# EAGLE board hodiny2_4beta (EAGLE 5.11), part 1 of 2
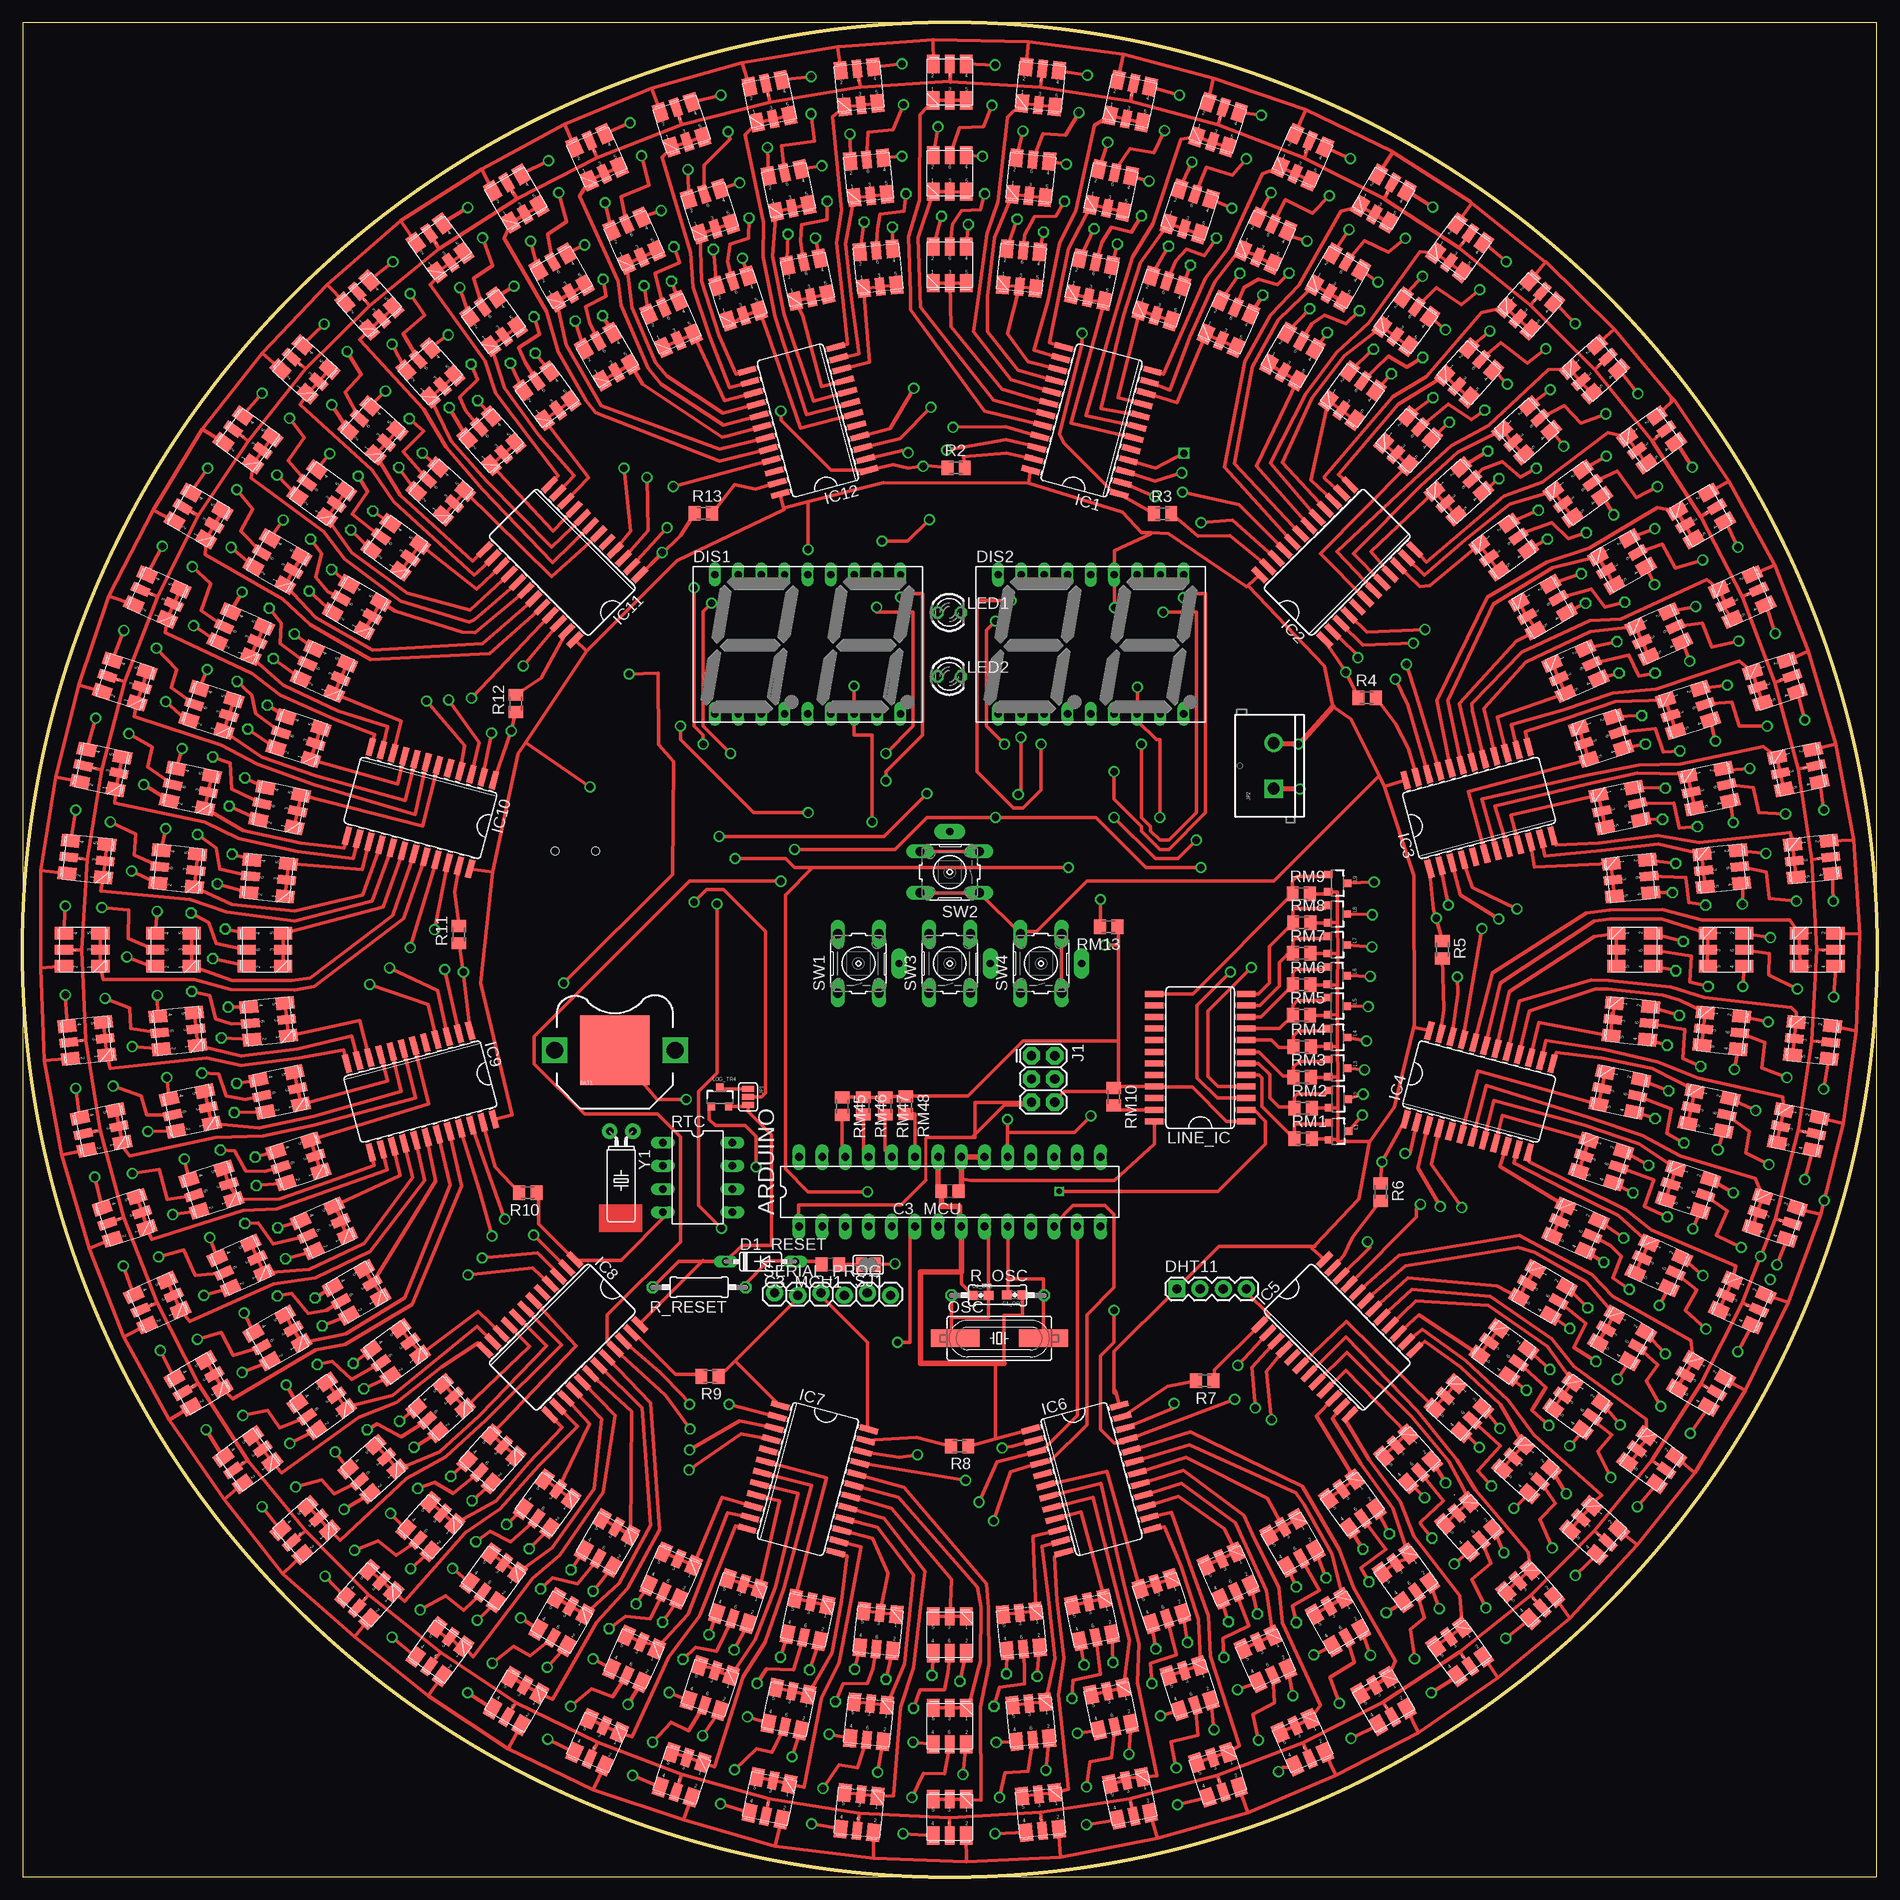
[diagram p6: board, top side]
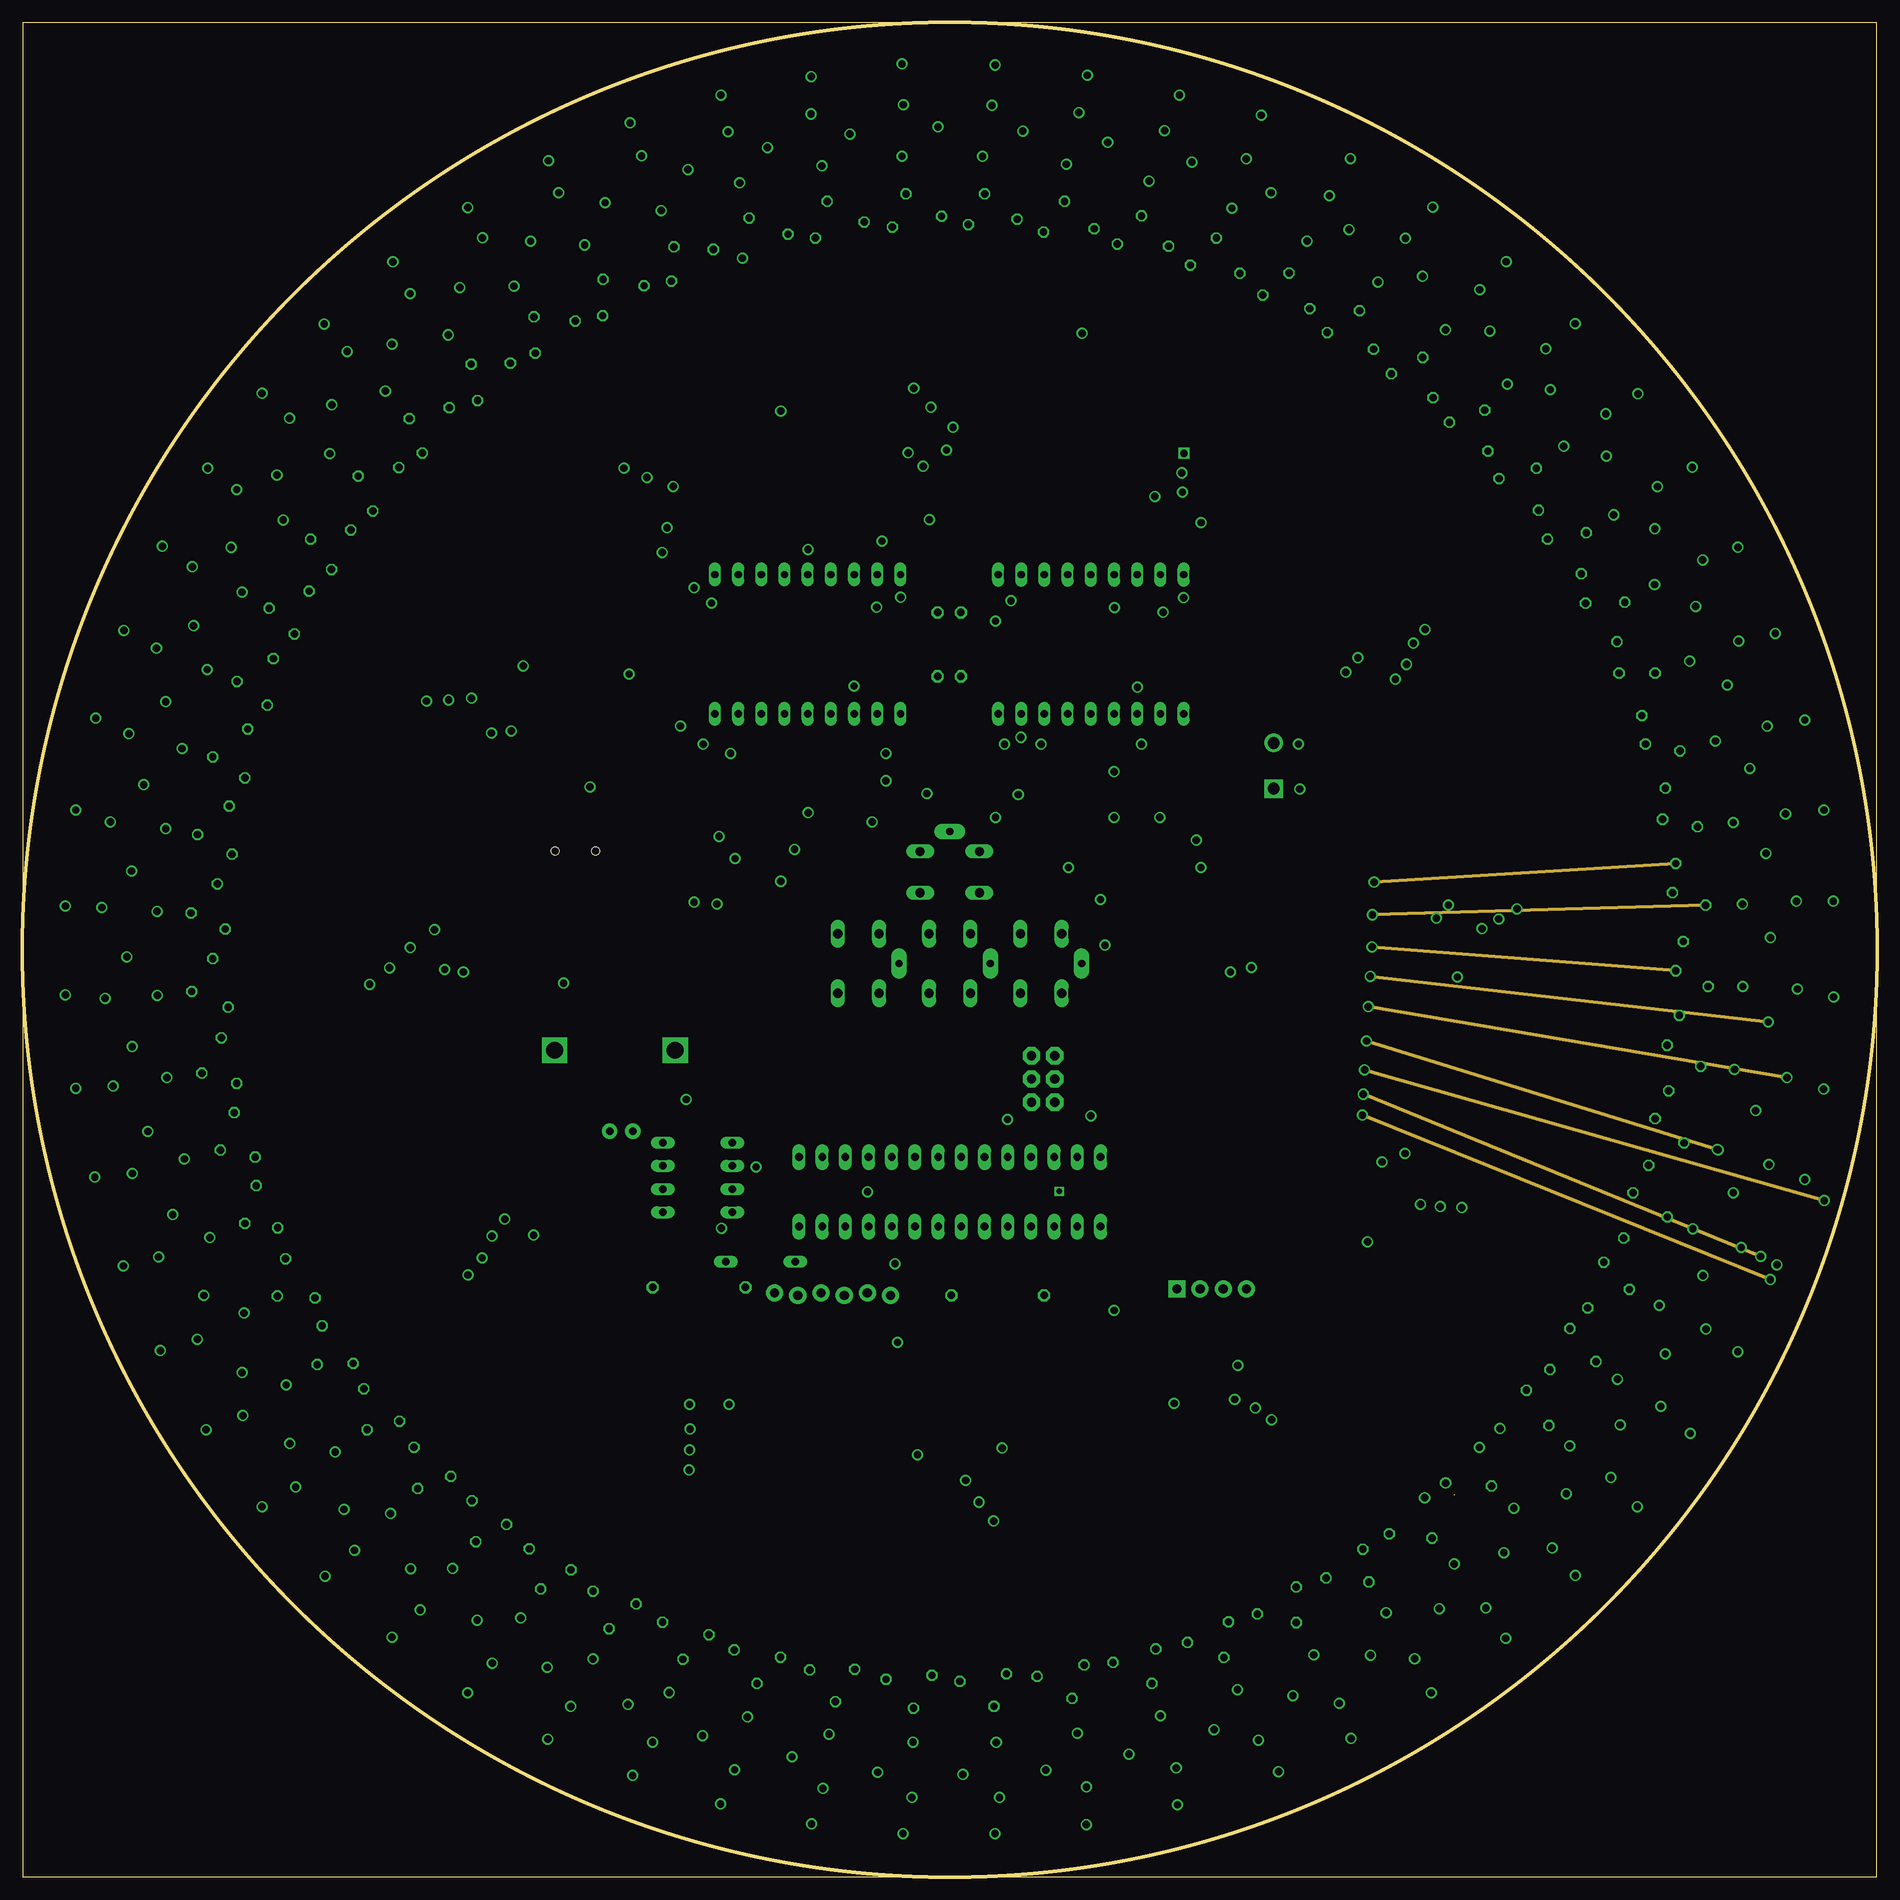
[diagram p7: board, inner layer Route14]
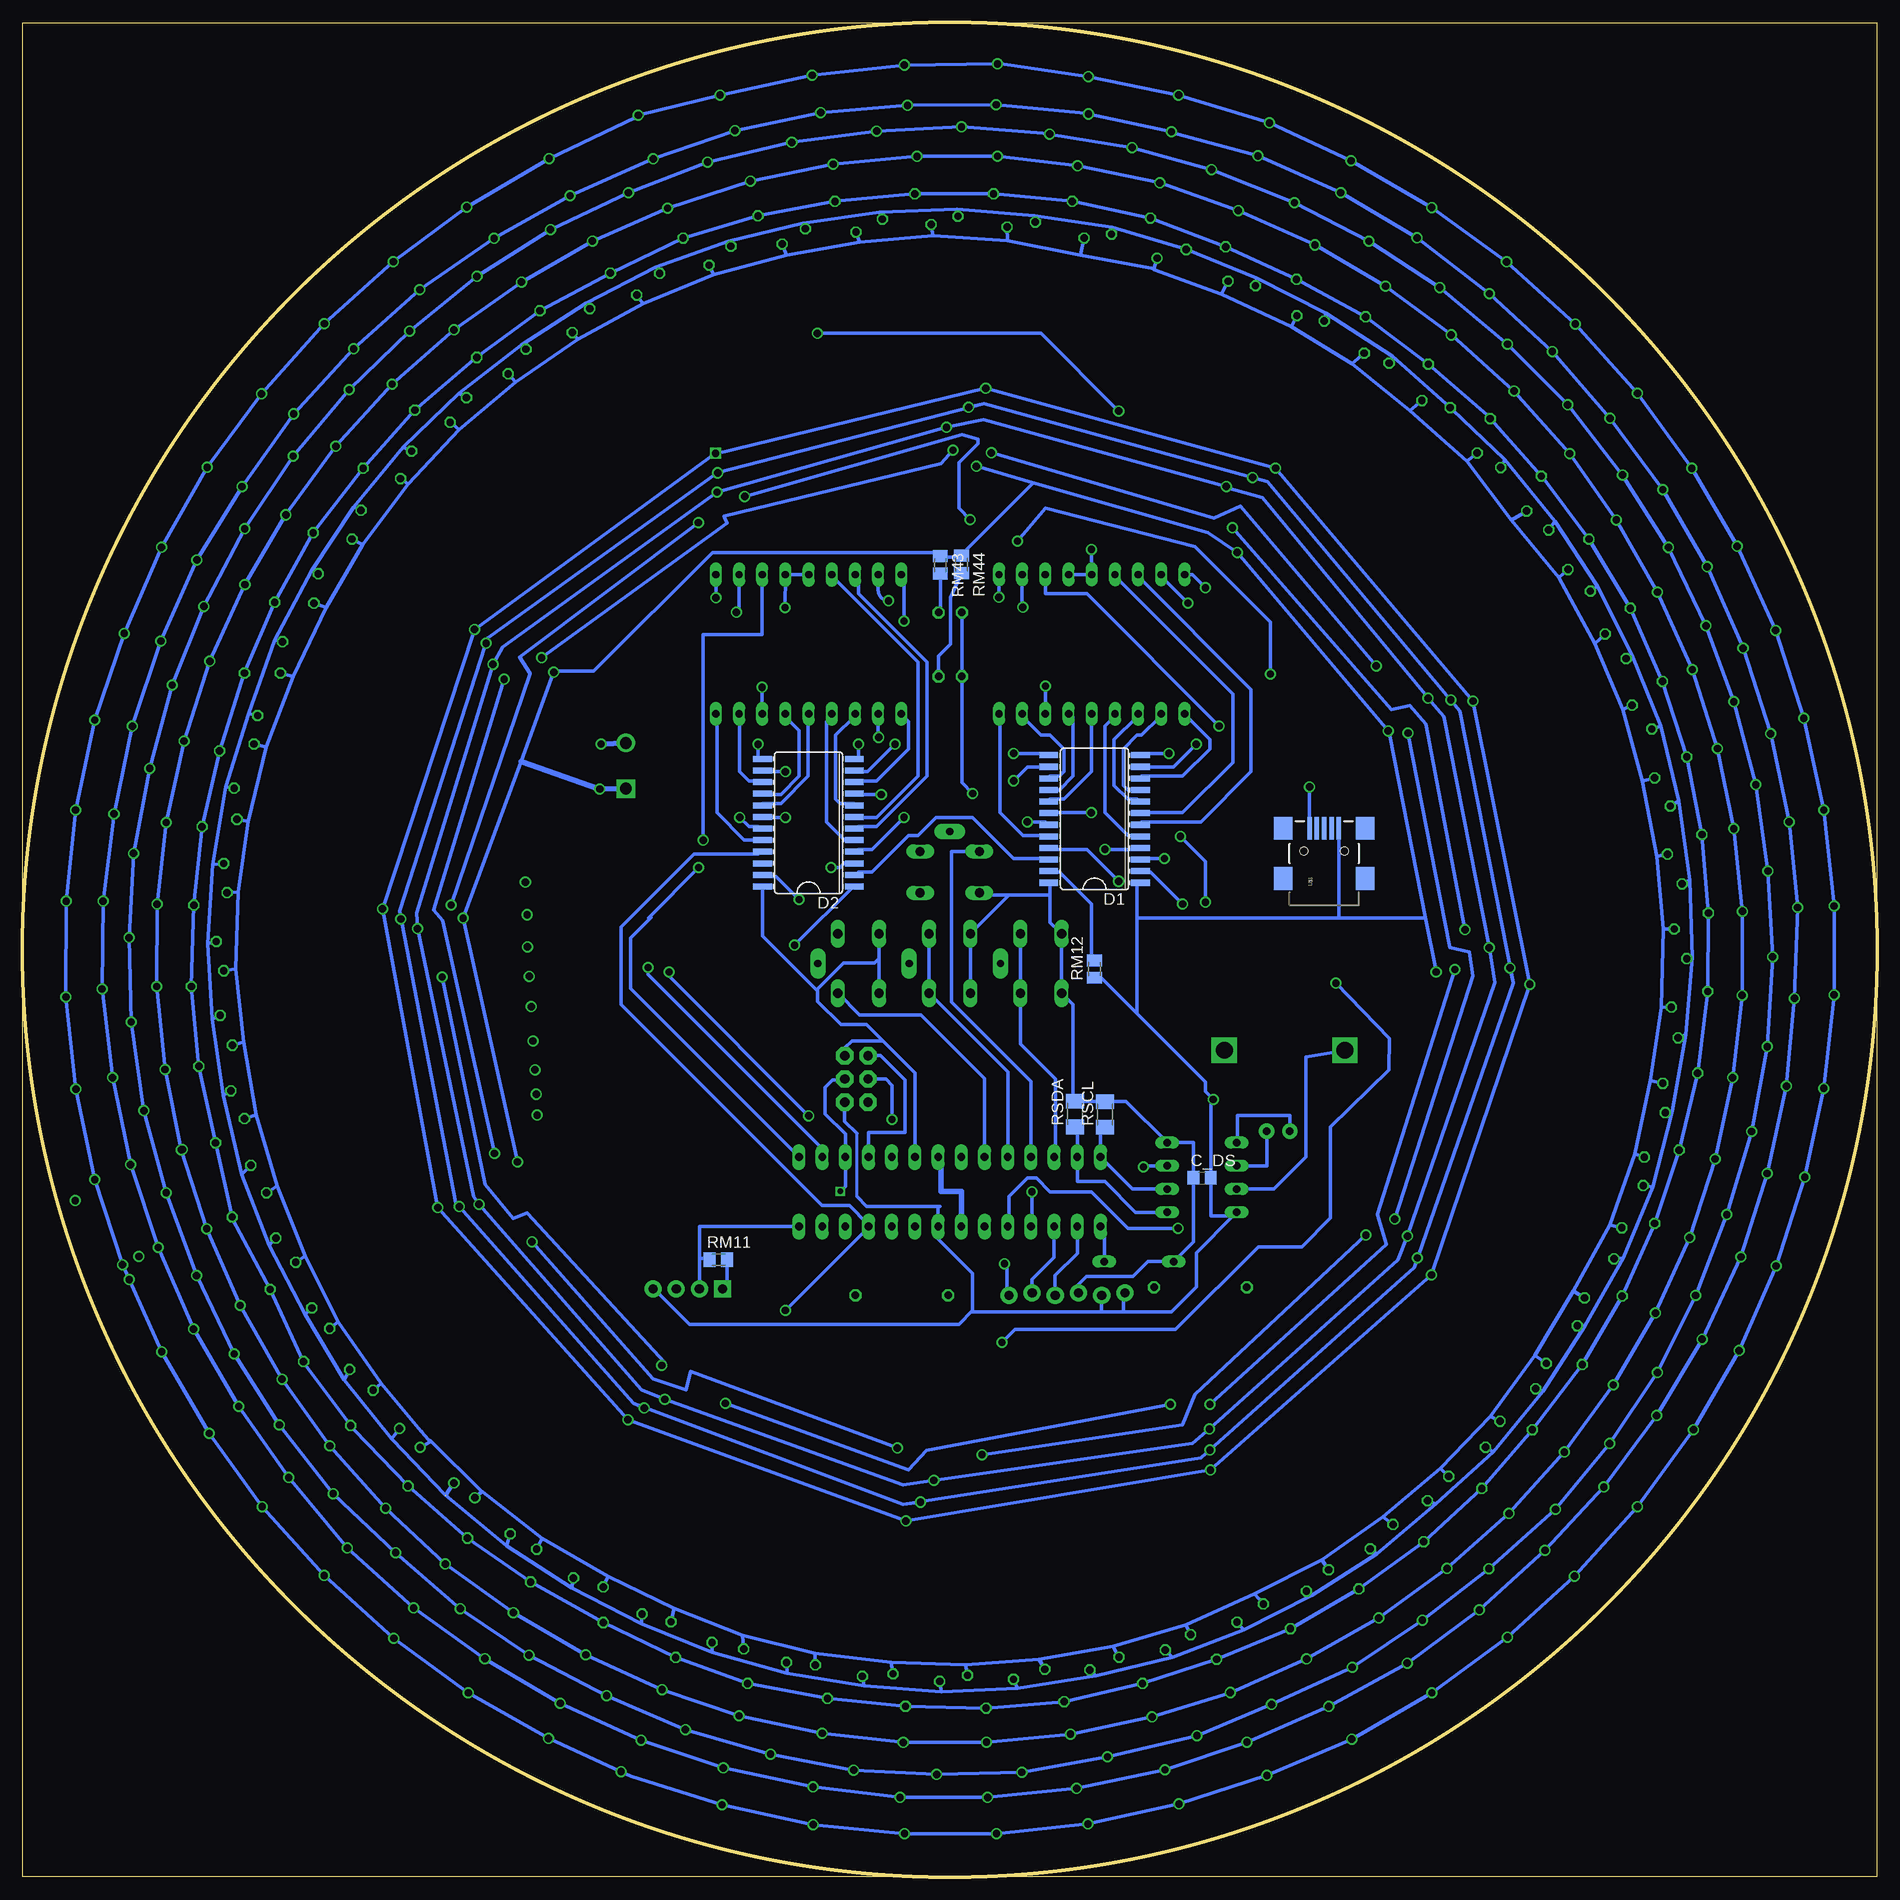
[diagram p8: board, bottom side, seen from below]

Size 203 x 203 mm. Coordinates in mm from the lower left corner, seen from the top.
Outline: 0,0 203,0 203,203 0,203 0,0
Outline: circle at 101.5,101.5 radius 101.5
Copper layers (1*14*15*16): Top 0.035mm / dielectric 1.5mm / Route14 0.035mm / dielectric 0.15mm / Route15 0.035mm / dielectric 0.2mm / Bottom-w 0.035mm
Design rules "default *": minimum track width 0.4mm, minimum drill 0.8mm, track to track 0.3mm, track to pad 0.3mm, pad to pad 0.3mm, via to via 0.3mm, smd to smd 0.2mm, copper to edge 40mil, drill to drill 1mm, minimum pad ring 10mil, minimum via ring 8mil, stop-mask expansion 0mil, vias tented up to drill 0mil, thermal gap 10mil

## Footprints (pad centres in the part's own frame; a part is rotated, then mirrored left to right if it is on the bottom)
SMARTPRJ_DIL28-3 = drill 0.85 pad 1.422 long: 1 -16.51,-3.81; 2 -13.97,-3.81; 3 -11.43,-3.81; 4 -8.89,-3.81; 5 -6.35,-3.81; 6 -3.81,-3.81; 7 -1.27,-3.81; 8 1.27,-3.81; 9 3.81,-3.81; 10 6.35,-3.81; 11 8.89,-3.81; 12 11.43,-3.81; 13 13.97,-3.81; 14 16.51,-3.81; 15 16.51,3.81; 16 13.97,3.81; 17 11.43,3.81; 18 8.89,3.81; 19 6.35,3.81; 20 3.81,3.81; 21 1.27,3.81; 22 -1.27,3.81; 23 -3.81,3.81; 24 -6.35,3.81; 25 -8.89,3.81; 26 -11.43,3.81; 27 -13.97,3.81; 28 -16.51,3.81
BATTCON_12MM_PTH = smd 7.62 x 7.62: GND 0,0 | drill 1.854 square: VCC@1 -6.604,0; VCC@2 6.604,0
0603-CAP = smd 1.1 x 1: 1 -0.85,0; 2 0.85,0
C0805 = smd 1.3 x 1.5: 1 -0.95,0; 2 0.95,0
SO24W = smd 0.66 x 2.032: 1 -6.985,-5.029; 2 -5.715,-5.029; 3 -4.445,-5.029; 4 -3.175,-5.029; 5 -1.905,-5.029; 6 -0.635,-5.029; 7 0.635,-5.029; 8 1.905,-5.029; 9 3.175,-5.029; 10 4.445,-5.029; 11 5.715,-5.029; 12 6.985,-5.029; 13 6.985,5.029; 14 5.715,5.029; 15 4.445,5.029; 16 3.175,5.029; 17 1.905,5.029; 18 0.635,5.029; 19 -0.635,5.029; 20 -1.905,5.029; 21 -3.175,5.029; 22 -4.445,5.029; 23 -5.715,5.029; 24 -6.985,5.029
DO35-7 = drill 0.813 long: A 3.81,0; C -3.81,0
1X04 = drill 1.016 pad 1.88 square: 1 0,0 | drill 1.016 pad 1.88 round: 2 2.54,0; 3 5.08,0; 4 7.62,0
HDSP-R = drill 0.813 long: 1 -10.16,-7.62; 2 -7.62,-7.62; 3 -5.08,-7.62; 4 -2.54,-7.62; 5 0,-7.62; 6 2.54,-7.62; 7 5.08,-7.62; 8 7.62,-7.62; 9 10.16,-7.62; 10 10.16,7.62; 11 7.62,7.62; 12 5.08,7.62; 13 2.54,7.62; 14 0,7.62; 15 -2.54,7.62; 16 -5.08,7.62; 17 -7.62,7.62; 18 -10.16,7.62
PLCC6 = smd 1.4 x 2: 1 1.8,2; 2 1.8,-2; 5 -1.8,2; 6 -1.8,-2 | smd 1 x 2: 3 0,2; 4 0,-2
2X3 = drill 1.016 pad 1.88 octagon: 1 0,0; 2 0,2.54; 3 2.54,0; 4 2.54,2.54; 5 5.08,0; 6 5.08,2.54
SJ_3 = smd 0.635 x 1.27: 1 -0.889,0; 2 0,0; 3 0.889,0
SCREWTERMINAL-5MM-2 = drill 1.3 pad 2.032 square: 1 0,0 | drill 1.3 pad 2.032 round: 2 5,0
SOT23-3 = smd 0.8 x 0.9: 1 -0.95,-1; 2 0.95,-1; 3 0,1.1
LED_LED3MM = drill 0.813 octagon: A -1.27,0; K 1.27,0
HC49UP = smd 5.334 x 1.93: 1 -4.826,0; 2 4.826,0
M0805 = smd 1.3 x 1.6: 1 -0.95,0; 2 0.95,0
0207/10 = drill 0.813 octagon: 1 -5.08,0; 2 5.08,0
SMARTPRJ_M1206 = smd 1.6 x 2: 1 -1.4,0; 2 1.4,0
DIL08 = drill 0.813 long: 1 -3.81,-3.81; 2 -1.27,-3.81; 3 1.27,-3.81; 4 3.81,-3.81; 5 3.81,3.81; 6 1.27,3.81; 7 -1.27,3.81; 8 -3.81,3.81
1X06_LOCK = drill 1.016 pad 1.88 round: 1 0,0; 2 2.54,-0.254; 3 5.08,0; 4 7.62,-0.254; 5 10.16,0; 6 12.7,-0.254
SJ = smd 1.168 x 1.6: 1 -0.762,0; 2 0.762,0
B3F-11XX = drill 1.016 long: 1 -3.251,2.261; 2 3.251,2.261; 3 -3.251,-2.261; 4 3.251,-2.261 | drill 0.8 pad 1.676 long: P$1 0,-4.445
USB-MINIB = smd 2.5 x 0.5: D+ 2.5,0; D- 2.5,0.8; GND 2.5,-1.6; ID 2.5,-0.8; VBUS 2.5,1.6 | smd 2.5 x 2: MTN1 -3,4.5; MTN2 2.5,4.5; MTN3 -3,-4.5; MTN4 2.5,-4.5 | hole 0.9: 0,2.2; 0,-2.2
TC38H = drill 0.813 pad 1.676 round: 1 -1.27,0; 2 1.27,0

## Placement (x,y rotation side)
ARDUINO  ATMEGA328P-PU  [SMARTPRJ_DIL28-3]  101.5,75 0 top
BAT1  [BATTCON_12MM_PTH]  64.84,90.5 0 top
C1_OSC  22pF  [0603-CAP]  108.6,63.69 180 top
C2_OSC  22pF  [0603-CAP]  104.89,63.66 0 top
C3_MCU  100nF  [C0805]  101.52,75.06 180 top
C3_MCU1  100nF  [C0805]  88.42,67.04 180 top
C_DS  100nF  [C0805]  73.87,76.53 0 bottom
D1  TLC5925SOIC24  [SO24W]  85.64,115.82 90 bottom
D1_RESET  1N4148  [DO35-7]  80.77,67.36 0 top
D2  TLC5925SOIC24  [SO24W]  116.97,115.41 90 bottom
DHT11  [1X04]  126.37,64.37 0 top
DIS1  HD-K121  [HDSP-R]  85.95,134.96 0 top
DIS2  HD-K121  [HDSP-R]  116.95,134.96 0 top
H0  PLCC6RGB  [PLCC6]  101.5,176.5 180 top
H1  PLCC6RGB  [PLCC6]  109.34,176.09 174 top
H2  PLCC6RGB  [PLCC6]  117.09,174.86 168 top
H3  PLCC6RGB  [PLCC6]  124.68,172.83 162 top
H4  PLCC6RGB  [PLCC6]  132.01,170.02 156 top
H5  PLCC6RGB  [PLCC6]  139,166.45 150 top
H6  PLCC6RGB  [PLCC6]  145.58,162.18 144 top
H7  PLCC6RGB  [PLCC6]  151.68,157.24 138 top
H8  PLCC6RGB  [PLCC6]  157.24,151.68 132 top
H9  PLCC6RGB  [PLCC6]  162.18,145.58 126 top
H10  PLCC6RGB  [PLCC6]  166.45,139 120 top
H11  PLCC6RGB  [PLCC6]  170.02,132.01 114 top
H12  PLCC6RGB  [PLCC6]  172.83,124.68 108 top
H13  PLCC6RGB  [PLCC6]  174.86,117.09 102 top
H14  PLCC6RGB  [PLCC6]  176.09,109.34 96 top
H15  PLCC6RGB  [PLCC6]  176.5,101.5 90 top
H16  PLCC6RGB  [PLCC6]  176.09,93.66 84 top
H17  PLCC6RGB  [PLCC6]  174.86,85.91 78 top
H18  PLCC6RGB  [PLCC6]  172.83,78.32 72 top
H19  PLCC6RGB  [PLCC6]  170.02,70.99 66 top
H20  PLCC6RGB  [PLCC6]  166.45,64 60 top
H21  PLCC6RGB  [PLCC6]  162.18,57.42 54 top
H22  PLCC6RGB  [PLCC6]  157.24,51.32 48 top
H23  PLCC6RGB  [PLCC6]  151.68,45.76 42 top
H24  PLCC6RGB  [PLCC6]  145.58,40.82 36 top
H25  PLCC6RGB  [PLCC6]  139,36.55 30 top
H26  PLCC6RGB  [PLCC6]  132.01,32.98 24 top
H27  PLCC6RGB  [PLCC6]  124.68,30.17 18 top
H28  PLCC6RGB  [PLCC6]  117.09,28.14 12 top
H29  PLCC6RGB  [PLCC6]  109.34,26.91 6 top
H30  PLCC6RGB  [PLCC6]  101.5,26.5 0 top
H31  PLCC6RGB  [PLCC6]  93.66,26.91 354 top
H32  PLCC6RGB  [PLCC6]  85.91,28.14 348 top
H33  PLCC6RGB  [PLCC6]  78.32,30.17 342 top
H34  PLCC6RGB  [PLCC6]  70.99,32.98 336 top
H35  PLCC6RGB  [PLCC6]  64,36.55 330 top
H36  PLCC6RGB  [PLCC6]  57.42,40.82 324 top
H37  PLCC6RGB  [PLCC6]  51.32,45.76 318 top
H38  PLCC6RGB  [PLCC6]  45.76,51.32 312 top
H39  PLCC6RGB  [PLCC6]  40.82,57.42 306 top
H40  PLCC6RGB  [PLCC6]  36.55,64 300 top
H41  PLCC6RGB  [PLCC6]  32.98,70.99 294 top
H42  PLCC6RGB  [PLCC6]  30.17,78.32 288 top
H43  PLCC6RGB  [PLCC6]  28.14,85.91 282 top
H44  PLCC6RGB  [PLCC6]  26.91,93.66 276 top
H45  PLCC6RGB  [PLCC6]  26.5,101.5 270 top
H46  PLCC6RGB  [PLCC6]  26.91,109.34 264 top
H47  PLCC6RGB  [PLCC6]  28.14,117.09 258 top
H48  PLCC6RGB  [PLCC6]  30.17,124.68 252 top
H49  PLCC6RGB  [PLCC6]  32.98,132.01 246 top
H50  PLCC6RGB  [PLCC6]  36.55,139 240 top
H51  PLCC6RGB  [PLCC6]  40.82,145.58 234 top
H52  PLCC6RGB  [PLCC6]  45.76,151.68 228 top
H53  PLCC6RGB  [PLCC6]  51.32,157.24 222 top
H54  PLCC6RGB  [PLCC6]  57.42,162.18 216 top
H55  PLCC6RGB  [PLCC6]  64,166.45 210 top
H56  PLCC6RGB  [PLCC6]  70.99,170.02 204 top
H57  PLCC6RGB  [PLCC6]  78.32,172.83 198 top
H58  PLCC6RGB  [PLCC6]  85.91,174.86 192 top
H59  PLCC6RGB  [PLCC6]  93.66,176.09 186 top
IC1  TLC5925SOIC24  [SO24W]  117.03,159.46 75 top
IC2  TLC5925SOIC24  [SO24W]  143.93,143.93 45 top
IC3  TLC5925SOIC24  [SO24W]  159.46,117.03 15 top
IC4  TLC5925SOIC24  [SO24W]  159.46,85.97 345 top
IC5  TLC5925SOIC24  [SO24W]  143.93,59.07 315 top
IC6  TLC5925SOIC24  [SO24W]  117.03,43.54 285 top
IC7  TLC5925SOIC24  [SO24W]  85.97,43.54 255 top
IC8  TLC5925SOIC24  [SO24W]  59.07,59.07 225 top
IC9  TLC5925SOIC24  [SO24W]  43.54,85.97 195 top
IC10  TLC5925SOIC24  [SO24W]  43.54,117.03 165 top
IC11  TLC5925SOIC24  [SO24W]  59.07,143.93 135 top
IC12  TLC5925SOIC24  [SO24W]  85.97,159.46 105 top
J1  AVR_SPI_PRG_6PTH  [2X3]  110.46,89.89 270 top
JP1  JUMPER-3SMD  [SJ_3]  79.41,85.38 270 top
JP2  [SCREWTERMINAL-5MM-2]  136.97,119.15 90 top
L1  P-FET  [SOT23-3]  144.03,81.63 270 top
L2  P-FET  [SOT23-3]  144.01,85.15 270 top
L3  P-FET  [SOT23-3]  143.95,88.53 270 top
L4  P-FET  [SOT23-3]  143.92,91.89 270 top
L5  P-FET  [SOT23-3]  143.9,95.32 270 top
L6  P-FET  [SOT23-3]  143.88,98.66 270 top
L7  P-FET  [SOT23-3]  143.88,102.03 270 top
L8  P-FET  [SOT23-3]  143.9,105.41 270 top
L9  P-FET  [SOT23-3]  143.93,108.78 270 top
LED1  [LED_LED3MM]  101.45,138.44 0 top
LED2  [LED_LED3MM]  101.45,131.44 0 top
LINE_IC  TLC5925SOIC24  [SO24W]  128.93,89.69 90 top
LOG_TR4  BCR198  [SOT23-3]  76.34,85.33 0 top
M0  PLCC6RGB  [PLCC6]  101.5,186.5 180 top
M1  PLCC6RGB  [PLCC6]  110.38,186.03 174 top
M2  PLCC6RGB  [PLCC6]  119.17,184.64 168 top
M3  PLCC6RGB  [PLCC6]  127.77,182.34 162 top
M4  PLCC6RGB  [PLCC6]  136.07,179.15 156 top
M5  PLCC6RGB  [PLCC6]  144,175.11 150 top
M6  PLCC6RGB  [PLCC6]  151.46,170.27 144 top
M7  PLCC6RGB  [PLCC6]  158.38,164.67 138 top
M8  PLCC6RGB  [PLCC6]  164.67,158.38 132 top
M9  PLCC6RGB  [PLCC6]  170.27,151.46 126 top
M10  PLCC6RGB  [PLCC6]  175.11,144 120 top
M11  PLCC6RGB  [PLCC6]  179.15,136.07 114 top
M12  PLCC6RGB  [PLCC6]  182.34,127.77 108 top
M13  PLCC6RGB  [PLCC6]  184.64,119.17 102 top
M14  PLCC6RGB  [PLCC6]  186.03,110.38 96 top
M15  PLCC6RGB  [PLCC6]  186.5,101.5 90 top
M16  PLCC6RGB  [PLCC6]  186.03,92.62 84 top
M17  PLCC6RGB  [PLCC6]  184.64,83.83 78 top
M18  PLCC6RGB  [PLCC6]  182.34,75.23 72 top
M19  PLCC6RGB  [PLCC6]  179.15,66.93 66 top
M20  PLCC6RGB  [PLCC6]  175.11,59 60 top
M21  PLCC6RGB  [PLCC6]  170.27,51.54 54 top
M22  PLCC6RGB  [PLCC6]  164.67,44.62 48 top
M23  PLCC6RGB  [PLCC6]  158.38,38.33 42 top
M24  PLCC6RGB  [PLCC6]  151.46,32.73 36 top
M25  PLCC6RGB  [PLCC6]  144,27.89 30 top
M26  PLCC6RGB  [PLCC6]  136.07,23.85 24 top
M27  PLCC6RGB  [PLCC6]  127.77,20.66 18 top
M28  PLCC6RGB  [PLCC6]  119.17,18.36 12 top
M29  PLCC6RGB  [PLCC6]  110.38,16.97 6 top
M30  PLCC6RGB  [PLCC6]  101.5,16.5 0 top
M31  PLCC6RGB  [PLCC6]  92.62,16.97 354 top
M32  PLCC6RGB  [PLCC6]  83.83,18.36 348 top
M33  PLCC6RGB  [PLCC6]  75.23,20.66 342 top
M34  PLCC6RGB  [PLCC6]  66.93,23.85 336 top
M35  PLCC6RGB  [PLCC6]  59,27.89 330 top
M36  PLCC6RGB  [PLCC6]  51.54,32.73 324 top
M37  PLCC6RGB  [PLCC6]  44.62,38.33 318 top
M38  PLCC6RGB  [PLCC6]  38.33,44.62 312 top
M39  PLCC6RGB  [PLCC6]  32.73,51.54 306 top
M40  PLCC6RGB  [PLCC6]  27.89,59 300 top
M41  PLCC6RGB  [PLCC6]  23.85,66.93 294 top
M42  PLCC6RGB  [PLCC6]  20.66,75.23 288 top
M43  PLCC6RGB  [PLCC6]  18.36,83.83 282 top
M44  PLCC6RGB  [PLCC6]  16.97,92.62 276 top
M45  PLCC6RGB  [PLCC6]  16.5,101.5 270 top
M46  PLCC6RGB  [PLCC6]  16.97,110.38 264 top
M47  PLCC6RGB  [PLCC6]  18.36,119.17 258 top
M48  PLCC6RGB  [PLCC6]  20.66,127.77 252 top
M49  PLCC6RGB  [PLCC6]  23.85,136.07 246 top
M50  PLCC6RGB  [PLCC6]  27.89,144 240 top
M51  PLCC6RGB  [PLCC6]  32.73,151.46 234 top
M52  PLCC6RGB  [PLCC6]  38.33,158.38 228 top
M53  PLCC6RGB  [PLCC6]  44.62,164.67 222 top
M54  PLCC6RGB  [PLCC6]  51.54,170.27 216 top
M55  PLCC6RGB  [PLCC6]  59,175.11 210 top
M56  PLCC6RGB  [PLCC6]  66.93,179.15 204 top
M57  PLCC6RGB  [PLCC6]  75.23,182.34 198 top
M58  PLCC6RGB  [PLCC6]  83.83,184.64 192 top
M59  PLCC6RGB  [PLCC6]  92.62,186.03 186 top
OSC  16MHz  [HC49UP]  106.93,58.95 0 top
R2  [M0805]  102.2,154.28 0 top
R3  [M0805]  124.8,149.25 0 top
R4  [M0805]  147.19,129.09 0 top
R5  [M0805]  155.45,101.51 270 top
R6  [M0805]  148.67,74.96 270 top
R7  [M0805]  129.42,54.31 180 top
R8  [M0805]  102.58,47.14 180 top
R9  [M0805]  75.24,54.79 180 top
R10  [M0805]  55.29,74.91 180 top
R11  [M0805]  47.76,103.17 90 top
R12  [M0805]  53.98,128.46 90 top
R13  [M0805]  74.53,149.28 0 top
R_OSC  1M  [0207/10]  106.75,63.66 0 top
R_RESET  10k  [0207/10]  74.05,64.55 180 top
RM1  [M0805]  140.2,80.81 0 top
RM2  [M0805]  140.2,84.15 0 top
RM3  [M0805]  140.1,87.54 0 top
RM4  [M0805]  140.08,90.89 0 top
RM5  [M0805]  140.01,94.32 0 top
RM6  [M0805]  140.03,97.66 0 top
RM7  [M0805]  140.03,101.1 0 top
RM8  [M0805]  140.05,104.45 0 top
RM9  [M0805]  140,107.62 0 top
RM10  [M0805]  119.43,85.4 270 top
RM11  [M0805]  126.84,67.58 0 bottom
RM12  [M0805]  85.66,99.38 90 bottom
RM13  [M0805]  118.9,104.01 180 top
RM43  [M0805]  102.53,143.64 270 bottom
RM44  [M0805]  100.22,143.69 270 bottom
RM45  [M0805]  89.72,84.36 270 top
RM46  [M0805]  92.04,84.41 270 top
RM47  [M0805]  94.43,84.38 270 top
RM48  [M0805]  96.7,84.47 270 top
RSCL  2k2  [SMARTPRJ_M1206]  84.5,83.47 90 bottom
RSDA  2k2  [SMARTPRJ_M1206]  87.79,83.5 90 bottom
RTC  DS1307  [DIL08]  73.87,76.57 270 top
S0  PLCC6RGB  [PLCC6]  101.5,196.5 180 top
S1  PLCC6RGB  [PLCC6]  111.43,195.98 174 top
S2  PLCC6RGB  [PLCC6]  121.25,194.42 168 top
S3  PLCC6RGB  [PLCC6]  130.86,191.85 162 top
S4  PLCC6RGB  [PLCC6]  140.14,188.29 156 top
S5  PLCC6RGB  [PLCC6]  149,183.77 150 top
S6  PLCC6RGB  [PLCC6]  157.34,178.36 144 top
S7  PLCC6RGB  [PLCC6]  165.07,172.1 138 top
S8  PLCC6RGB  [PLCC6]  172.1,165.07 132 top
S9  PLCC6RGB  [PLCC6]  178.36,157.34 126 top
S10  PLCC6RGB  [PLCC6]  183.77,149 120 top
S11  PLCC6RGB  [PLCC6]  188.29,140.14 114 top
S12  PLCC6RGB  [PLCC6]  191.85,130.86 108 top
S13  PLCC6RGB  [PLCC6]  194.42,121.25 102 top
S14  PLCC6RGB  [PLCC6]  195.98,111.43 96 top
S15  PLCC6RGB  [PLCC6]  196.5,101.5 90 top
S16  PLCC6RGB  [PLCC6]  195.98,91.57 84 top
S17  PLCC6RGB  [PLCC6]  194.42,81.75 78 top
S18  PLCC6RGB  [PLCC6]  191.85,72.14 72 top
S19  PLCC6RGB  [PLCC6]  188.29,62.86 66 top
S20  PLCC6RGB  [PLCC6]  183.77,54 60 top
S21  PLCC6RGB  [PLCC6]  178.36,45.66 54 top
S22  PLCC6RGB  [PLCC6]  172.1,37.93 48 top
S23  PLCC6RGB  [PLCC6]  165.07,30.9 42 top
S24  PLCC6RGB  [PLCC6]  157.34,24.64 36 top
S25  PLCC6RGB  [PLCC6]  149,19.23 30 top
S26  PLCC6RGB  [PLCC6]  140.14,14.71 24 top
S27  PLCC6RGB  [PLCC6]  130.86,11.15 18 top
S28  PLCC6RGB  [PLCC6]  121.25,8.58 12 top
S29  PLCC6RGB  [PLCC6]  111.43,7.02 6 top
S30  PLCC6RGB  [PLCC6]  101.5,6.5 0 top
S31  PLCC6RGB  [PLCC6]  91.57,7.02 354 top
S32  PLCC6RGB  [PLCC6]  81.75,8.58 348 top
S33  PLCC6RGB  [PLCC6]  72.14,11.15 342 top
S34  PLCC6RGB  [PLCC6]  62.86,14.71 336 top
S35  PLCC6RGB  [PLCC6]  54,19.23 330 top
S36  PLCC6RGB  [PLCC6]  45.66,24.64 324 top
S37  PLCC6RGB  [PLCC6]  37.93,30.9 318 top
S38  PLCC6RGB  [PLCC6]  30.9,37.93 312 top
S39  PLCC6RGB  [PLCC6]  24.64,45.66 306 top
S40  PLCC6RGB  [PLCC6]  19.23,54 300 top
S41  PLCC6RGB  [PLCC6]  14.71,62.86 294 top
S42  PLCC6RGB  [PLCC6]  11.15,72.14 288 top
S43  PLCC6RGB  [PLCC6]  8.58,81.75 282 top
S44  PLCC6RGB  [PLCC6]  7.02,91.57 276 top
S45  PLCC6RGB  [PLCC6]  6.5,101.5 270 top
S46  PLCC6RGB  [PLCC6]  7.02,111.43 264 top
S47  PLCC6RGB  [PLCC6]  8.58,121.25 258 top
S48  PLCC6RGB  [PLCC6]  11.15,130.86 252 top
S49  PLCC6RGB  [PLCC6]  14.71,140.14 246 top
S50  PLCC6RGB  [PLCC6]  19.23,149 240 top
S51  PLCC6RGB  [PLCC6]  24.64,157.34 234 top
S52  PLCC6RGB  [PLCC6]  30.9,165.07 228 top
S53  PLCC6RGB  [PLCC6]  37.93,172.1 222 top
S54  PLCC6RGB  [PLCC6]  45.66,178.36 216 top
S55  PLCC6RGB  [PLCC6]  54,183.77 210 top
S56  PLCC6RGB  [PLCC6]  62.86,188.29 204 top
S57  PLCC6RGB  [PLCC6]  72.14,191.85 198 top
S58  PLCC6RGB  [PLCC6]  81.75,194.42 192 top
S59  PLCC6RGB  [PLCC6]  91.57,195.98 186 top
SERIAL_PROG  FTDI Compatible  [1X06_LOCK]  82.32,63.91 0 top
SJ1  [SJ]  92.57,67 180 top
SW1  sw  [B3F-11XX]  91.5,100 90 top
SW2  sw  [B3F-11XX]  101.5,110 180 top
SW3  sw  [B3F-11XX]  101.5,100 90 top
SW4  sw  [B3F-11XX]  111.5,100 90 top
U$1  USB-MINIB-5PIN  [USB-MINIB]  60.5,112.29 90 bottom
Y1  32.768kHz  [TC38H]  65.53,81.62 180 top

## Tracks (layer width: path | path; a pad name or v marks a point on that pad's centre or on a via)
+5V  (via drill 0.8)
  Top 0.4: IC7.24 92.5,49 92.5,58.5 87.5,63.5 SERIAL_PROG.3 | IC8.24 67.5,60.5 74.5,67.5 74.5,67.36 | SW2.1 105,107.5 109,103.5 SW4.2 109.5,103.5 111,103.5 116.5,109 137,109 148.5,120.5 148.54,120.52 | 119.69,53.05 119.5,53 119.5,57.5 126,64 DHT11.1 126.5,64.5 131,69 141.5,69 141.41,69.09 | 123.51,147.16 123.5,147 | 85.98,150.56 86,150.5 | 144,80.7 144,80.5 147.5,80.5 147.48,80.51
  Top 0.406: R_RESET.2 71.78,67.36 74.5,67.36 D1_RESET.C 78.75,69.14 82,69.1 82,81.2 79.41,83.78 JP1.3 79.25,84.33 LOG_TR4.2 | RM1.2 143.03,80.81 L1.2 143.03,80.7 144,80.7 144.03,80.7 144.03,84.2 | RM2.2 143.01,84.15 L2.2 144.03,84.2 | RM3.2 142.95,87.54 L3.2 144,87.58 | 142.92,90.89 L4.2 | 142.92,90.89 RM4.2 | RM5.2 142.9,94.32 L5.2 143.95,94.39 | 142.88,97.66 L6.2 | 142.88,97.66 RM6.2 | 142.88,101.1 L7.2 | 142.88,101.1 RM7.2 | RM8.2 142.9,104.45 L8.2 143.97,104.46 | RM9.2 142.93,107.62 L9.2 143.97,107.83 143.97,104.46 | 144.03,84.2 144,87.58 | 143.97,90.89 142.92,90.89 | 143.97,90.89 143.95,94.39 | 144,87.58 143.97,90.89 | 143.95,94.39 143.95,97.66 | 143.95,97.66 142.88,97.66 | 143.95,97.66 143.98,101.1 | 143.98,101.1 142.88,101.1 | 143.98,101.1 143.97,104.46 | LINE_IC.24 123.9,80.22 119.52,76.21 103.85,76.21 102.77,76.42 | SW2.1 SW2.2 | IC9.24 53.58,83.41 50.11,97.89 51.42,110.02 | 51.42,110.02 IC10.24 | 61.71,134.22 IC11.24 | 61.71,134.22 55.05,124.19 | 55.05,124.19 54.24,122.98 51.42,110.02 | 83.3,149.89 83.35,149.67 71.66,144.11 61.71,134.22 | 83.3,149.89 IC12.24 | 110.11,152.6 IC1.24 | 110.11,152.6 94.25,152.65 85.98,150.56 83.3,149.89 | 134.13,141.37 133.99,141.24 125.45,147.09 123.51,147.16 122.47,147.2 120.39,149.45 110.11,152.6 | 134.13,141.37 IC2.24 | 149.11,119.38 IC3.24 | 149.11,119.38 148.54,120.52 145.4,126.74 143.43,128.15 142.53,132.59 134.13,141.37 | IC4.24 152.37,92.96 152.37,93.3 | 152.37,93.3 152.31,109.66 149.11,119.38 | IC5.24 141.13,68.79 141.41,69.09 146.3,74.19 147.43,80.43 147.48,80.51 150.18,84.31 152.37,93.3 | IC6.24 119.69,53.05 119.66,53.17 | 55.05,124.19 v62.1,119.33 | 86,150.5 v85.99,145.33
  Top 0.406: 123.5,147 119.53,145.22 v119.53,138.98
  Top 0.61: C3_MCU.1 102.77,75.36 102.77,76.42 ARDUINO.21 ARDUINO.20 | v139.67,124.02 136.94,124.1 139.79,124.02 143.43,128.15
  Bottom-w 0.4: 90.5,107.5 90.5,104.5 89.5,103.5 SW1.2 | 90.5,107.5 90.5,109 D1.24 | 95,107.5 98,107.5 SW2.2 | 95,107.5 90.5,107.5 | 95,107.5 99,103.5 SW3.2 | D2.24 122,108.5 122,103 116,97 115.96,97 | RSDA.2 88,85 88,95.5 89,96.5 SW1.1
  Bottom-w 0.406: SERIAL_PROG.3 87.4,64.84 86.52,65.73 81.46,65.73 79.81,67.38 76.98,67.38 D1_RESET.C 74.82,69.5 C_DS.1 74.82,80.38 RTC.8 82.18,84.87 RSCL.2 84.5,84.9 RSDA.2 | J1.2 113,90.74 112.22,91.51 108.82,91.51 | 108.82,91.51 105.31,88 ARDUINO.20 | RM11.2 125.89,64.37 DHT11.1 | SW1.2 SW1.1 | 109.24,100.52 SW4.1 | SW4.2 109.24,100.52 | SW3.2 SW3.1 | 108.82,91.51 110.63,93.32 113.43,93.32 115.96,95.86 115.96,97 115.96,97.21 113.13,100.04 109.71,100.04 109.24,100.52 | v62.1,119.33 U$1.VBUS | v85.99,145.33 DIS1.14 DIS1.13 | v119.53,138.98 DIS2.13 DIS2.14
  Bottom-w 0.61: ARDUINO.7 100.23,75.06 C3_MCU.1 102.47,78.81 ARDUINO.21 | JP2.2 v139.67,124.02
CLK  (via drill 0.8)
  Top 0.4: ARDUINO.13 115.5,71 115.5,50.5 111.5,46.5 IC6.3
  Top 0.406: IC1.3 123.99,152.82 v126.91,153.72 | IC2.3 146.75,134.84 v152.27,135.06 | v161.6,104.86 157.39,107.47 IC3.3 | v155.2,73.37 152.78,77.58 IC4.3 | v134.95,51.32 134.6,55.77 IC5.3 | v104.7,41.02 106.69,45.42 IC6.3 | v73.02,46.71 78.48,49.91 IC7.3 | v50.3,67.75 56.35,68.29 58.66,65.99 IC8.3 | v40.16,99.51 45.42,97.06 IC9.3 | v46.63,128.86 49.99,124.18 IC10.3 | v68.33,153.21 68.45,147.4 IC11.3 | v99.44,160.9 96.08,157.47 IC12.3
  Bottom-w 0.406: 161.76,105.72 152.36,134.78 v152.27,135.06 152.09,135.62 v126.91,153.72 97.74,161.31 | 161.76,105.72 155.63,73.85 | 155.63,73.85 136.13,51.82 | 106.62,40.75 136.13,51.82 | 74.02,45.86 106.62,40.75 | 50.64,66.72 74.02,45.86 | 39.79,97.85 50.64,66.72 | 45.64,127.64 39.79,97.85 | 66.72,152.76 45.64,127.64 | 97.74,161.31 66.72,152.76 | 161.76,105.72 v161.6,104.86 | 155.63,73.85 v155.2,73.37 | 136.13,51.82 v134.95,51.32 | 106.62,40.75 v104.7,41.02 | 74.02,45.86 v73.02,46.71 | 50.64,66.72 v50.3,67.75 | 39.79,97.85 v40.16,99.51 | 45.64,127.64 v46.63,128.86 | 66.72,152.76 v68.33,153.21 | 97.74,161.31 v99.44,160.9
CLK3  (via drill 0.8)
  Top 0.4: v78,111.5 83.5,111.5 84.5,110.5 86.5,110.5 | 86.5,110.5 v114.5,110.5 | v92.5,75 86,75 83.5,77.5 83.5,107.5 86.5,110.5
  Bottom-w 0.4: v78,111.5 80.5,111.5 D1.3 | v114.5,110.5 113.5,110.5 113,111 112,111 D2.3 | v92.5,75 92.5,71.5 ARDUINO.4
F1
  Top 0.406: LINE_IC.5 135.37,87.79 135.71,87.44 135.71,84.35 RM1.1 139.25,82.4 139.24,82.41 142.86,82.41 L1.1
F2
  Top 0.406: L2.1 142.62,85.71 139.59,85.71 139.25,85.36 RM2.1 139.14,84.26 137.56,84.26 136.55,85.28 136.55,87.82 135.31,89.06 LINE_IC.6
F3
  Top 0.406: L3.1 142.72,89.26 139.76,89.26 139.15,88.64 RM3.1 138.98,87.7 137.99,87.7 135.37,90.33 LINE_IC.7
F4
  Top 0.406: L4.1 142.69,92.61 139.67,92.61 139.13,92.07 RM4.1 139.04,90.8 137.53,90.8 136.73,91.6 LINE_IC.8
F5
  Top 0.406: L5.1 142.56,95.93 139.57,95.93 139.06,95.42 RM5.1 137.6,92.87 LINE_IC.9
F6
  Top 0.406: L6.1 142.59,99.33 139.4,99.33 139.08,99.01 RM6.1 | RM6.1 138.64,98.1 | LINE_IC.10 135.56,94.14 RM6.1
F7
  Top 0.406: L7.1 142.63,102.73 139.28,102.73 139.08,102.52 139.08,101.61 | 139.08,101.61 RM7.1 | LINE_IC.11 135.49,95.41 137.59,97.51 137.59,100.12 139.08,101.61
F8
  Top 0.406: L8.1 142.57,106.03 139.19,106.03 139.1,105.94 RM8.1 136.49,101.84 136.49,97.85 135.31,96.68 LINE_IC.12
F9
  Top 0.4: L9.1 142.5,109.5 139.5,109.5 139,109 139,108 RM9.1
  Top 0.406: 138.93,107.74 RM9.1 128.1,96.68 LINE_IC.13
GND  (via drill 0.8)
  Top 0.4: R7.1 130.5,54.5 130.5,55.5 135,60 IC5.1 135.5,60.5 136.5,61.5 134,64 DHT11.4 | 114,157 119.5,151.5 120,151.5 IC1.1 | v83,160.5 83,159.5 88.5,154 92.5,154 IC12.1 | 120,91.5 120,86.5 RM10.1 119,86 114,86 113,85 J1.6 | 120,91.5 120,102 | 120,102 120,104 RM13.1 | 120,102 v118.5,102 | 120,91.5 109.5,91.5 103.5,85.5 97,85.5 RM48.1 | R10.1 56.5,74.5 56.5,71.5 60,68 IC8.1 60.5,67.5 65.5,67.5 70.5,72.5 RTC.4 | 78,56.5 85,63.5 SERIAL_PROG.2 | 78,56.5 76.5,55 R9.1 | 78,56.5 82.5,52 IC7.1 | 106.51,47.95 106.5,48 106.5,56.22
  Top 0.406: C2_OSC.1 102.77,64.93 102.77,66.22 | C1_OSC.1 109.45,61.44 107.46,61.44 107.46,56.22 | BAT1.GND 69.47,85.1 v72.65,85.1 | RM10.1 119.6,86.52 LINE_IC.21 124.04,86.38 124.44,86.38 124.52,86.46 128.06,86.46 131.81,82.71 LINE_IC.1 | RM45.1 89.72,85.36 RM46.1 92.04,85.33 RM47.1 94.43,85.42 RM48.1 | IC3.1 154.46,105.94 R5.1 v154.79,104.96 | R6.1 v148.84,78.26 IC4.1 | IC2.1 v144.86,131.89 R4.1 | IC1.1 R3.1 | R2.1 99.04,154.49 v98.6,154.44 96.95,154.23 95.26,154.6 IC12.1 | R13.1 72.03,146.88 IC11.1 v70.02,145 | IC10.1 v53.49,125.47 R12.1 | IC9.1 v48.24,99.06 R11.1 | R8.1 106.51,47.95 IC6.1 | 114,157 113.53,157.96 115.97,167.82 v116,169
  Top 0.61: ARDUINO.22 100.23,75.41 C3_MCU.2 100.58,73.42 102.59,73.42 102.59,71.19 ARDUINO.8 102.77,66.22 98.28,66.22 98.28,56.22 106.5,56.22 107.46,56.22 | v137.02,119.14 v139.83,119.1
  Bottom-w 0.305: 111.67,74.47 111.67,81.38
  Bottom-w 0.4: 92.45,152.67 92.5,152.5 100,145 RM44.1 100.5,144.5 102.5,144.5 RM43.1 103,145 127.5,145 140.5,132 144.5,132 v144.86,131.89 | v116,169 91.5,169 v83,160.5 | v118.5,102 112,108.5 D2.1 | 81,105 81,94.5 80.99,94.51 | 81,105 81,109 D1.1 | DHT11.4 133.5,64 130,60.5 100.5,60.5 99,62 98.99,61.85 | 81,105 58.89,105 49.5,105 49.4,105.02
  Bottom-w 0.406: 70.47,72.35 74.5,68.32 74.5,64.55 77.21,61.85 82.5,61.85 | 70.47,72.35 RTC.4 | 82.5,61.85 84.86,61.85 | SERIAL_PROG.1 82.5,63.91 82.5,61.85 | 84.86,61.85 SERIAL_PROG.2 | 84.86,61.85 98.99,61.85 98.99,66.07 102.77,69.85 ARDUINO.8 102.77,73.24 102.59,73.42 110.61,73.42 111.67,74.47 | J1.6 113,82.71 111.67,81.38 | 70.47,72.35 72.92,72.35 C_DS.2 72.92,84.82 v72.65,85.1 73.51,85.96 73.51,87.03 80.99,94.51 84.91,98.43 RM12.1 | v148.84,78.26 v154.79,104.96 148.46,122.12 v144.86,131.89 | v98.6,154.44 92.45,152.67 73.25,147.16 v70.02,145 v53.49,125.47 53.28,124.89 49.4,105.02 v48.24,99.06 | 58.89,105 U$1.GND
  Bottom-w 0.61: v139.83,119.1 JP2.1 | v137.02,119.14 139.91,119.1 148.46,122.12
H1
  Top 0.406: IC1.15 110.08,165.91 107.8,168.99 H1.3 | H1.3 H1.5 | H1.3 H1.1
H2
  Top 0.406: IC2.15 141.07,152.94 H6.1 H6.3 H6.5
H3
  Top 0.406: IC3.15 161.46,126.97 H11.5 H11.3 H11.1
H4
  Top 0.406: IC4.15 166.02,93.51 H16.5 174,94.49 H16.3 H16.1
H5
  Top 0.406: IC5.15 152.85,61.52 H21.5 H21.3 H21.1
H6
  Top 0.406: IC6.15 126.54,41.67 131.6,38.06 H26.1 H26.3 H26.5
H7
  Top 0.406: IC7.15 93.03,37.05 94.73,33.19 H31.3 | H31.3 H31.1 | H31.3 H31.5
H8
  Top 0.406: IC8.15 62.09,49.57 H36.3 | H36.3 H36.5 | H36.3 H36.1
H9
  Top 0.406: IC9.15 41.32,76.79 H41.5 35.28,71.37 H41.3 H41.1
H10
  Top 0.406: IC10.15 37.15,110.29 H46.5 H46.3 H46.1
H11
  Top 0.406: IC11.15 49.71,141.02 H51.5 H51.3 H51.1
H12
  Top 0.406: IC12.15 76.84,161.61 H56.5 71.02,167.85 H56.3 H56.1
HB  (via drill 0.8)
  Top 0.4: 145,102 L7.3 | v153.5,41.5 152,43 H23.6 | v159.5,47 158,48.5 H22.6
  Top 0.406: H57.6 79.14,176.07 v78.79,177.23 | v38.32,149.54 H51.6 | v43.75,155.91 H52.6 | v49.8,161.64 H53.6 | v56.12,166.83 H54.6 | v63.49,170.93 H55.6 | v71.03,174.72 H56.6 | v86.79,179.44 H58.6 | v95.22,180.65 H59.6 | v103.53,180.92 H0.6 | v111.77,180.1 H1.6 | v119.85,178.77 H2.6 | v127.85,176.47 H3.6 | v135.77,173.19 H4.6 | v142.83,169.09 H5.6 | v149.86,164.57 H6.6 | v156.22,159.26 H7.6 | v161.64,153.09 H8.6 | v166.95,146.46 H9.6 | v171.12,139.44 H10.6 | v174.79,131.79 H11.6 | v177.68,124.02 H12.6 | v179.55,115.79 H13.6 | v180.65,107.75 H14.6 | v181,99.2 H15.6 | v180.06,91.05 H16.6 | v178.73,83.01 H17.6 | v176.31,74.89 H18.6 | v173.12,67.28 H19.6 | v169.41,60.02 H20.6 | v164.65,53.27 H21.6 | v146.73,35.86 H24.6 | v139.44,31.73 H25.6 | v132.02,27.9 H26.6 | v124.06,24.94 H27.6 | v116.22,23.18 H28.6 | v107.71,22.2 H29.6 | v99.55,22.05 H30.6 | v91.08,22.71 H31.6 | v82.97,24.04 H32.6 | v75.12,26.5 H33.6 | v67.16,29.85 H34.6 | v60.02,33.6 H35.6 | v52.96,38.56 H36.6 | v46.87,43.83 H37.6 | v41.25,49.87 H38.6 | v36.18,56.2 H39.6 | v32,63.38 H40.6 | v27.9,71.06 H41.6 | v25.44,78.79 H42.6 | v23.41,86.87 H43.6 | v22.48,95.22 H44.6 | v22.17,103.77 H45.6 | v22.91,111.96 H46.6 | v24.31,120.31 H47.6 | v26.77,128.28 H48.6 | v29.74,136.08 H49.6 | v33.8,143.14 H50.6 | v147.74,101.82 145,102
  Route14 0.406: v181,99.2 v147.74,101.82
  Bottom-w 0.4: 159.36,48.78 159.34,48.74 | v153.5,41.5 153,42 152.72,42.12 | v159.5,47 158.41,47.6 158.36,47.72
  Bottom-w 0.406: 87.2,177.54 79.14,176.07 v78.79,177.23 | 87.2,177.54 95.17,179.12 | 95.17,179.12 103.35,179.68 | 103.35,179.68 111.38,178.99 | 111.38,178.99 119.38,177.58 | 119.38,177.58 127.34,175.43 | 127.34,175.43 135.07,172.22 | 135.07,172.22 142.2,168.37 | 142.2,168.37 149.03,163.65 | 149.03,163.65 155.24,158.47 | 155.24,158.47 160.8,152.5 | 160.8,152.5 165.79,145.87 | 165.79,145.87 169.8,138.99 | 169.8,138.99 173.39,131.41 | 173.39,131.41 176.33,123.67 | 176.33,123.67 178.32,115.55 | 178.32,115.55 179.39,107.8 | 179.39,107.8 179.67,99.41 | 179.67,99.41 178.84,91.4 | 178.84,91.4 177.44,83.42 | 177.44,83.42 175.18,75.62 | 175.18,75.62 172.08,67.99 | 172.08,67.99 168.46,60.76 | 168.46,60.76 163.76,54.02 | 163.76,54.02 159.36,48.78 158.56,47.85 158.36,47.72 152.72,42.12 152.66,42.12 146.15,37.07 | 146.15,37.07 138.93,32.88 | 138.93,32.88 131.68,29.39 | 131.68,29.39 124.19,26.42 | 124.19,26.42 116.27,24.48 | 116.27,24.48 107.92,23.47 | 107.92,23.47 99.75,23.22 | 99.75,23.22 91.73,23.78 | 91.73,23.78 83.62,25.23 | 83.62,25.23 75.66,27.56 | 75.66,27.56 68.14,30.96 | 68.14,30.96 60.76,34.7 | 60.76,34.7 54.05,39.39 | 54.05,39.39 47.76,44.69 | 47.76,44.69 42.32,50.43 | 42.32,50.43 37.42,57.07 | 37.42,57.07 33.21,64.14 | 33.21,64.14 29.2,71.37 | 29.2,71.37 26.47,79.14 | 26.47,79.14 24.77,87.21 | 24.77,87.21 23.6,95.19 | 23.6,95.19 23.34,103.78 | 23.34,103.78 24.1,111.69 | 24.1,111.69 25.66,119.99 | 25.66,119.99 27.82,127.8 | 27.82,127.8 30.88,135.05 | 30.88,135.05 34.82,142.27 | 34.82,142.27 39.99,148.56 | 39.99,148.56 44.87,155.01 | 44.87,155.01 51.09,160.53 | 51.09,160.53 57.45,165.68 | 57.45,165.68 64.08,169.72 | 64.08,169.72 71.73,173.31 | 71.73,173.31 79.13,175.98
  Bottom-w 0.406: 39.99,148.56 v38.32,149.54 | 44.87,155.01 v43.75,155.91 | 51.09,160.53 v49.8,161.64 | 57.45,165.68 v56.12,166.83 | 64.08,169.72 v63.49,170.93 | 71.73,173.31 v71.03,174.72 | 87.2,177.54 v86.79,179.44 | 95.17,179.12 v95.22,180.65 | 103.35,179.68 v103.53,180.92 | 111.38,178.99 v111.77,180.1 | 119.38,177.58 v119.85,178.77 | 127.34,175.43 v127.85,176.47 | 135.07,172.22 v135.77,173.19 | 142.2,168.37 v142.83,169.09 | 149.03,163.65 v149.86,164.57 | 155.24,158.47 v156.22,159.26 | 160.8,152.5 v161.64,153.09 | 165.79,145.87 v166.95,146.46 | 169.8,138.99 v171.12,139.44 | 173.39,131.41 v174.79,131.79 | 176.33,123.67 v177.68,124.02 | 178.32,115.55 v179.55,115.79 | 179.39,107.8 v180.65,107.75 | 179.67,99.41 v181,99.2 | 178.84,91.4 v180.06,91.05 | 177.44,83.42 v178.73,83.01 | 175.18,75.62 v176.31,74.89 | 172.08,67.99 v173.12,67.28 | 168.46,60.76 v169.41,60.02 | 163.76,54.02 v164.65,53.27 | 146.15,37.07 v146.73,35.86 | 138.93,32.88 v139.44,31.73 | 131.68,29.39 v132.02,27.9 | 124.19,26.42 v124.06,24.94 | 116.27,24.48 v116.22,23.18 | 107.92,23.47 v107.71,22.2 | 99.75,23.22 v99.55,22.05 | 91.73,23.78 v91.08,22.71 | 83.62,25.23 v82.97,24.04 | 75.66,27.56 v75.12,26.5 | 68.14,30.96 v67.16,29.85 | 60.76,34.7 v60.02,33.6 | 54.05,39.39 v52.96,38.56 | 47.76,44.69 v46.87,43.83 | 42.32,50.43 v41.25,49.87 | 37.42,57.07 v36.18,56.2 | 33.21,64.14 v32,63.38 | 29.2,71.37 v27.9,71.06 | 26.47,79.14 v25.44,78.79 | 24.77,87.21 v23.41,86.87 | 23.6,95.19 v22.48,95.22 | 23.34,103.78 v22.17,103.77 | 24.1,111.69 v22.91,111.96 | 25.66,119.99 v24.31,120.31 | 27.82,127.8 v26.77,128.28 | 30.88,135.05 v29.74,136.08 | 34.82,142.27 v33.8,143.14
HG  (via drill 0.8)  (1 unrouted)
  Top 0.406: v46.7,160.86 H53.2 | v31.35,140.76 H50.2 | v35.91,147.46 H51.2 | v41.17,154.31 H52.2 | v53.39,165.74 H54.2 | v60.49,170.34 H55.2 | v68.02,174.21 H56.2 | v75.63,178.19 H57.2 | v83.79,179.87 83.67,177.02 H58.2 | v92.14,181.19 H59.2 | v100.61,181.82 H0.2 | v108.88,181.5 H1.2 | v117.31,180.45 H2.2 | v125.47,178.54 H3.2 | v133.27,175.57 H4.2 | v140.92,171.71 H5.2 | v147.91,167.26 H6.2 | v154.42,161.95 H7.2 | v160.43,156.1 H8.2 | v165.97,149.62 H9.2 | v170.66,142.68 H10.2 | v174.56,135.22 H11.2 | v177.29,127.14 H12.2 | v179.87,119.18 H13.2 | v181,110.95 H14.2 | v181.82,102.4 H15.2 | v181.39,94.32 H16.2 | v180.22,86.05 H17.2 | H18.2 v178.03,77.89 | v175.3,69.93 H19.2 | v171.36,62.28 H20.2 | v167.22,55.53 H21.2 | v149.62,37.54 H24.2 | v142.71,32.7 H25.2 | v135.18,28.76 H26.2 | v127.53,25.64 H27.2 | v119.38,23.45 H28.2 | v111.06,21.93 H29.2 | v102.6,21.39 H30.2 | v94.52,21.62 H31.2 | v86.17,22.63 H32.2 | v77.89,24.82 H33.2 | v70.05,27.86 H34.2 | v62.44,31.26 H35.2 | v55.45,35.9 H36.2 | v49.17,41.18 H37.2 | v42.84,47.03 H38.2 | v37.35,53.42 H39.2 | v32.78,60.33 H40.2 | v28.76,67.67 H41.2 | v25.56,75.67 H42.2 | v23.14,83.67 H43.2 | v21.74,91.86 H44.2 | v20.8,100.53 H45.2 | v21.31,108.72 H46.2 | v22.6,117.23 H47.2 | v24.62,125.68 H48.2 | v27.43,133.39 H49.2 | v161.76,49.07 H22.2 | H23.2 v155.8,43.11 | v147.97,108.89 L9.3
  Route14 0.406: v181,110.95 v147.97,108.89
  Bottom-w 0.406: 53.03,166.52 v46.7,160.86 | 60.33,171.2 53.03,166.52 | 67.86,175.03 60.33,171.2 | 67.86,175.03 v75.63,178.19 83.75,180.65 | 92.22,181.9 83.75,180.65 | 100.72,182.6 92.22,181.9 | 109.19,182.29 100.72,182.6 | 117.54,181.04 109.19,182.29 | 125.74,179.09 117.54,181.04 | 133.7,176.24 125.74,179.09 | 141.35,172.29 133.7,176.24 | 148.45,167.69 141.35,172.29 | 155.24,162.46 148.45,167.69 | 161.37,156.53 155.24,162.46 | 166.79,149.97 161.37,156.53 | 171.4,143.03 166.79,149.97 | 175.42,135.42 171.4,143.03 | 178.27,127.34 175.42,135.42 | 180.8,119.3 178.27,127.34 | 182.21,110.83 180.8,119.3 | 182.75,102.21 182.21,110.83 | 182.29,93.93 182.75,102.21 | 181.08,85.58 182.29,93.93 | 179.05,76.92 181.08,85.58 | 179.05,76.92 176,69.11 | 176,69.11 172.06,61.54 | 172.06,61.54 167.81,54.4 | 167.81,54.4 162.6,47.96 | 162.6,47.96 162.54,47.88 156.76,41.84 150.01,36.22 | 150.01,36.22 142.91,31.61 | 142.91,31.61 135.26,27.71 | 135.26,27.71 127.53,24.55 | 127.53,24.55 119.34,22.28 | 119.34,22.28 110.91,20.92 | 110.91,20.92 102.4,20.25 | 102.4,20.25 94.09,20.64 | 94.09,20.64 85.5,21.97 | 85.5,21.97 77.11,24.04 | 77.11,24.04 69.31,27.04 | 69.31,27.04 61.85,30.83 | 61.85,30.83 54.71,35.36 | 54.71,35.36 48.27,40.82 | 48.27,40.82 41.95,46.52 | 41.95,46.52 36.53,53.15 | 36.53,53.15 31.96,60.33 | 31.96,60.33 27.75,67.73 | 27.75,67.73 24.51,75.54 | 24.51,75.54 22.36,83.86 | 22.36,83.86 20.92,92.22 | 20.92,92.22 20.18,100.64 | 20.18,100.64 20.49,109.15 | 20.49,109.15 21.66,117.78 | 21.66,117.78 23.65,125.97 | 23.65,125.97 26.81,133.82 | 26.81,133.82 30.6,141.35 | 30.6,141.35 35.24,148.41 | 35.24,148.41 40.74,155.16 | 40.74,155.16 46.52,160.71 | 30.6,141.35 v31.35,140.76 | 35.24,148.41 v35.91,147.46
  Bottom-w 0.406: 40.74,155.16 v41.17,154.31 | 53.03,166.52 v53.39,165.74 | 60.33,171.2 v60.49,170.34 | 67.86,175.03 v68.02,174.21 | 83.75,180.65 v83.79,179.87 | 92.22,181.9 v92.14,181.19 | 100.72,182.6 v100.61,181.82 | 109.19,182.29 v108.88,181.5 | 117.54,181.04 v117.31,180.45 | 125.74,179.09 v125.47,178.54 | 133.7,176.24 v133.27,175.57 | 141.35,172.29 v140.92,171.71 | 148.45,167.69 v147.91,167.26 | 155.24,162.46 v154.42,161.95 | 161.37,156.53 v160.43,156.1 | 166.79,149.97 v165.97,149.62 | 171.4,143.03 v170.66,142.68 | 175.42,135.42 v174.56,135.22 | 178.27,127.34 v177.29,127.14 | 180.8,119.3 v179.87,119.18 | 182.21,110.83 v181,110.95 | 182.75,102.21 v181.82,102.4 | 182.29,93.93 v181.39,94.32 | 181.08,85.58 v180.22,86.05 | v178.03,77.89 179.05,76.92 | 176,69.11 v175.3,69.93 | 172.06,61.54 v171.36,62.28 | 167.81,54.4 v167.22,55.53 | 150.01,36.22 v149.62,37.54 | 142.91,31.61 v142.71,32.7 | 135.26,27.71 v135.18,28.76 | 127.53,24.55 v127.53,25.64 | 119.34,22.28 v119.38,23.45 | 110.91,20.92 v111.06,21.93 | 102.4,20.25 v102.6,21.39 | 94.09,20.64 v94.52,21.62 | 85.5,21.97 v86.17,22.63 | 77.11,24.04 v77.89,24.82 | 69.31,27.04 v70.05,27.86 | 61.85,30.83 v62.44,31.26 | 54.71,35.36 v55.45,35.9 | 48.27,40.82 v49.17,41.18 | 41.95,46.52 v42.84,47.03 | 36.53,53.15 v37.35,53.42 | 31.96,60.33 v32.78,60.33 | 27.75,67.73 v28.76,67.67 | 24.51,75.54 v25.56,75.67 | 22.36,83.86 v23.14,83.67 | 20.92,92.22 v21.74,91.86 | 20.18,100.64 v20.8,100.53 | 20.49,109.15 v21.31,108.72 | 21.66,117.78 v22.6,117.23 | 23.65,125.97 v24.62,125.68 | 26.81,133.82 v27.43,133.39 | 162.6,47.96 v161.76,49.07 | v155.8,43.11 156.68,41.76
IO8
  Bottom-w 0.406: 128.91,67.72 128.91,71.19 ARDUINO.14 | 128.91,67.72 DHT11.2 | RM11.1 127.79,67.72 128.91,67.72
LE  (via drill 0.8)
  Top 0.4: ARDUINO.12 113,71.5 115,73.5 118.5,73.5 119.5,72.5 119.5,64.5 116.5,61.5 116.5,49.5 112.5,45.5 111.5,45.5 IC6.4
  Top 0.406: IC1.4 124.04,154.23 v127.14,155.86 | v153.55,136.58 147.2,136.3 IC2.4 | v163.62,105.98 158.72,108.31 IC3.4 | v157.55,73.27 154.23,78.01 IC4.4 | v136.75,50.03 136.16,55.34 IC5.4 | v106.3,38.94 108.14,44.33 IC6.4 | v72.95,44.53 78.64,48.47 IC7.4 | v48.74,65.9 55.84,66.66 IC8.4 | v37.97,97.72 44.37,95.49 IC9.4 | v44.2,128.73 48.39,123.86 IC10.4 | v65.82,154.23 66.58,147.32 IC11.4 | v97.56,162.98 94.95,158.56 IC12.4
  Bottom-w 0.406: v127.14,155.86 v153.55,136.58 v163.62,105.98 v157.55,73.27 v136.75,50.03 v106.3,38.94 v72.95,44.53 v48.74,65.9 v37.97,97.72 v44.2,128.73 v65.82,154.23 v97.56,162.98 127.27,155.77
LE2  (via drill 0.8)
  Top 0.406: LINE_IC.4 130.88,86.52 129.78,87.61 129.78,94.81 v134.53,99.56
  Bottom-w 0.406: v134.53,99.56 134.53,98.81 115.47,79.75 ARDUINO.16
LE3  (via drill 0.8)
  Top 0.4: v84.5,112.5 95.5,112.5 99,116 v106.5,116 117.5,116 123,110.5 v129,110.5
  Bottom-w 0.4: v84.5,112.5 81,112.5 D1.4 | v106.5,116 110,112.5 111.5,112.5 D2.4 | v129,110.5 134.5,105 134.37,104.87
  Bottom-w 0.406: ARDUINO.15 136.43,97.23 136.43,102.8 134.37,104.87 134.23,105
MB  (via drill 0.8)
  Top 0.406: v96.28,188.4 M59.6 | v105.09,188.37 M0.6 | v114.26,187.52 M1.6 | v123.34,185.67 M2.6 | v132.41,182.71 M3.6 | v140.63,179.1 138.04,179.84 M4.6 | v148.41,174.62 M5.6 | v155.79,169.38 M6.6 | v162.55,163.43 M7.6 | v168.73,156.63 M8.6 | v174.19,149.12 M9.6 | v178.68,141.48 M10.6 | v182.52,133.09 M11.6 | v185.35,124.34 M12.6 | v187.3,115.44 M13.6 | v188.31,106.49 188.4,109.31 M14.6 | v188.34,97.48 M15.6 | v187.43,88.38 M16.6 | M17.6 v185.64,79.6 v185.53,79.64 | M18.6 v182.88,70.95 | v179.2,62.56 M19.6 | v174.62,54.47 M20.6 | v169.38,47.18 171.26,49.23 M21.6 | v163.27,40.35 M22.6 | v156.73,34.24 M23.6 | v149.28,28.91 M24.6 | v141.35,24.29 M25.6 | v132.99,20.49 M26.6 | v124.57,17.62 M27.6 | v115.47,15.71 M28.6 | v106.59,14.7 M29.6 | v97.48,14.73 M30.6 | v88.28,15.61 M31.6 | v79.34,17.49 M32.6 | v70.79,20.16 M33.6 | v62.43,23.84 M34.6 | v54.53,28.32 M35.6 | v47.05,33.75 M36.6 | v40.26,39.77 M37.6 | v34.21,46.5 M38.6 | v28.84,53.85 M39.6 | v24.23,61.72 M40.6 | v20.49,69.98 M41.6 | v17.69,78.59 M42.6 | v15.77,87.5 M43.6 | v14.73,96.51 M44.6 | v14.7,105.71 M45.6 | v15.64,114.75 M46.6 | v17.43,123.53 M47.6 | v20.19,132.18 M48.6 | v24,140.67 M49.6 | v28.52,148.57 M50.6 | v33.62,155.82 M51.6 | v39.7,162.68 M52.6 | v46.6,168.83 M53.6 | v53.78,174.16 M54.6 | v61.52,178.68 M55.6 | v69.91,182.45 M56.6 | v78.5,185.48 M57.6 | v87.5,187.33 M58.6 | v147.15,91.5 L4.3
  Route14 0.406: v185.53,79.64 v147.15,91.5
  Bottom-w 0.406: v105.09,188.37 v96.28,188.4 v87.5,187.33 v78.5,185.48 v69.91,182.45 v61.52,178.68 v53.78,174.16 v46.6,168.83 v39.7,162.68 v33.62,155.82 v28.52,148.57 v24,140.67 v20.19,132.18 v17.43,123.53 v15.64,114.75 v14.7,105.71 v14.73,96.51 v15.77,87.5 v17.69,78.59 v20.49,69.98 v24.23,61.72 v28.84,53.85 v34.21,46.5 v40.26,39.77 v47.05,33.75 v54.53,28.32 v62.43,23.84 v70.79,20.16 v79.34,17.49 v88.28,15.61 v97.48,14.73 v106.59,14.7 v115.47,15.71 v124.57,17.62 v132.99,20.49 v141.35,24.29 v149.28,28.91 v156.73,34.24 v163.27,40.35 v169.38,47.18 v174.62,54.47 v179.2,62.56 v182.88,70.95 v185.64,79.6 v187.43,88.38 v188.34,97.48 v188.31,106.49 v187.3,115.44 v185.35,124.34 v182.52,133.09 v178.68,141.48 v174.19,149.12 v168.73,156.63 v162.55,163.43 v155.79,169.38 v148.41,174.62 v140.63,179.1 v132.41,182.71 v123.34,185.67 v114.26,187.52 v105.09,188.37
MG  (via drill 0.8)
  Top 0.406: v90.56,190.82 M59.2 | v81.52,189.35 M58.2 | v100.21,191.61 M0.2 | v109.5,191.15 M1.2 | v118.8,189.9 M2.2 | v128.01,187.76 M3.2 | v136.68,184.4 M4.2 | v145.22,180.36 M5.2 | v153.27,175.24 M6.2 | v160.64,169.25 M7.2 | v167.28,162.83 M8.2 | v173.4,155.54 M9.2 | v178.71,147.6 M10.2 | v183.17,139.1 M11.2 | v186.63,130.48 M12.2 | v189.1,121.36 185.33,121.09 185.72,121.17 M13.2 | v190.88,112.05 M14.2 | v191.37,102.82 M15.2 | v191.12,93.59 M16.2 | v189.75,83.88 M17.2 | v187.3,74.89 M18.2 | v183.98,65.82 M19.2 | v179.86,57.24 M20.2 | v174.92,49.47 M21.2 | v169.01,41.94 M22.2 | v162.18,35.48 M23.2 | v155.09,29.34 M24.2 | v147.58,24.26 M25.2 | v139.07,19.83 M26.2 | v130.44,16.09 M27.2 | v121.12,13.41 M28.2 | v112.02,11.66 M29.2 | v102.93,11.2 M30.2 | v93.61,11.43 M31.2 | v84.24,13.12 M32.2 | v74.42,15.45 M33.2 | v66.26,18.85 M34.2 | v57.42,22.93 M35.2 | v49.75,28.08 M36.2 | v42.46,33.72 M37.2 | v35.17,40.23 M38.2 | v29.25,47.42 M39.2 | v24,55.2 M40.2 | v19.82,63.65 M41.2 | v16.42,72.49 M42.2 | v13.7,81.6 M43.2 | v11.98,90.89 M44.2 | v11.39,100.72 13.94,99.71 M45.2 | v11.9,110.13 15.23,108.53 M46.2 | v13.23,119.57 M47.2 | v15.65,128.66 17.71,126.8 M48.2 | v18.69,136.98 M49.2 | v22.79,145.56 M50.2 | v27.82,153.49 M51.2 | v33.84,161.17 M52.2 | v40.43,167.81 M53.2 | v47.84,174.01 M54.2 | v55.61,179.09 M55.2 | v63.77,183.3 M56.2 | M57.2 v72.82,186.93 | v147.55,98.59 L6.3
  Route14 0.406: v191.12,93.59 v147.55,98.59
  Bottom-w 0.406: v90.56,190.82 90.59,190.85 v100.21,191.61 v109.5,191.15 v118.8,189.9 v128.01,187.76 v136.68,184.4 v145.22,180.36 v153.27,175.24 v160.64,169.25 v167.28,162.83 v173.4,155.54 v178.71,147.6 v183.17,139.1 v186.63,130.48 v189.1,121.36 v190.88,112.05 v191.37,102.82 v191.12,93.59 v189.75,83.88 v187.3,74.89 v183.98,65.82 v179.86,57.24 v174.92,49.47 v169.01,41.94 v162.18,35.48 v155.09,29.34 v147.58,24.26 v139.07,19.83 v130.44,16.09 v121.12,13.41 v112.02,11.66 v102.93,11.2 v93.61,11.43 v84.24,13.12 v74.42,15.45 v66.26,18.85 v57.42,22.93 v49.75,28.08 v42.46,33.72 v35.17,40.23 v29.25,47.42 v24,55.2 v19.82,63.65 v16.42,72.49 v13.7,81.6 v11.98,90.89 v11.39,100.72 v11.9,110.13 v13.23,119.57 v15.65,128.66 v18.69,136.98 v22.79,145.56 v27.82,153.49 v33.84,161.17 v40.43,167.81 v47.84,174.01 v55.61,179.09 v63.77,183.3 v72.82,186.93 v81.52,189.35 90.66,190.79
MR  (via drill 0.8)
  Top 0.406: M57.4 74.59,187.43 77.45,190.26 v77.23,191.07 | v96.41,194.03 95.3,191.3 92.57,191.03 M59.4 | v106.14,193.96 105.21,191.61 102.56,191.5 M0.4 | v115.63,193.18 114.15,190.68 111.69,190.87 M1.4 | v125.03,191.2 123.86,188.8 121.21,189.23 119.81,187.12 M2.4 | v133.97,188.11 132.45,186.31 129.6,187.16 M3.4 | v143.07,184.08 141.23,182.17 138.26,183.61 M4.4 | v151.4,179.4 149.5,177.88 146.89,179.16 M5.4 | v159.53,173.77 157.54,172.14 154.81,174.01 M6.4 | v166.78,167.3 164.76,165.74 161.84,168 M7.4 | v173.35,160.18 170.58,159.18 168.82,161.09 M8.4 | v179,152.21 176.67,150.99 174.6,153.91 M9.4 | v183.95,144.18 180.96,143.3 179.55,145.91 M10.4 | v187.88,135.3 184.94,134.64 183.93,137.29 M11.4 | v191,125.97 187.98,125.97 187.12,128.63 M12.4 | v193.02,116.38 190.09,116.53 189.47,119.26 M13.4 | v194.22,106.82 191.26,107.12 190.91,110.01 M14.4 | v194.32,97.19 191.18,98.73 191.26,101.08 M15.4 | v193.18,87.5 190.4,88.55 190.75,91.36 M16.4 | v191.2,77.97 188.69,79.26 189.08,81.6 M17.4 | v188.18,68.9 185.45,70.21 186.62,72.9 M18.4 | v184.31,59.96 182.05,62.01 183.3,64.27 M19.4 | v179.36,51.51 177.8,54.28 179.05,56.04 M20.4 | v173.9,43.7 172.45,46.56 173.97,48.39 171.32,50.46 M21.4 | v167.46,36 166.13,39.14 167.81,40.86 M22.4 | v160.21,29.43 158.68,32.55 160.74,34.3 M23.4 | v152.41,23.87 151.92,27.08 153.45,28.33 M24.4 | v144.15,18.99 143.14,21.82 145.84,23.45 M25.4 | v135.3,14.96 134.71,17.76 137.06,19.04 M26.4 | v126.3,11.9 125.7,14.79 128.66,15.49 M27.4 | v116.47,9.82 116.84,12.57 119.18,12.99 M28.4 | v106.95,8.68 107.55,11.36 110.05,11.55 M29.4 | v97.36,8.68 98.62,11.32 100.92,11.24 M30.4
  Top 0.406: v87.6,9.66 89.37,12.25 91.4,11.9 M31.4 | v77.94,11.71 80.35,14.01 82.03,13.62 M32.4 | v68.97,14.73 70.99,16.9 72.9,16 M33.4 | v59.99,18.63 62.28,20.57 64.59,19.71 M34.4 | v51.41,23.38 53.74,25.25 55.57,24.2 M35.4 | v43.51,29.2 46.32,30.75 48.27,29.19 M36.4 | v36.32,35.74 38.91,36.8 40.86,35.16 M37.4 | v29.88,42.66 32.7,43.47 34.07,41.91 M38.4 | v24.09,50.5 26.81,51.05 28.1,49.13 M39.4 | v19.12,58.85 21.7,59.59 23.02,57.09 M40.4 | v14.86,67.86 17.64,68.64 18.89,65.83 M41.4 | v12,77 14.95,77.47 15.8,74.15 M42.4 | v9.88,86.56 12.96,85.47 13.54,83.44 M43.4 | v9.01,96.19 11.71,95.1 11.82,92.88 M44.4 | v8.65,106.14 11.59,105.88 11.55,102.71 M45.4 | v9.59,115.5 12.37,114.15 12.18,111.89 M46.4 | v11.61,125.16 14.17,123.71 13.7,121.48 M47.4 | v14.63,134.52 16.86,132.18 16.27,130.19 M48.4 | v18.57,143.43 20.57,141.58 19.55,138.62 M49.4 | v23.41,151.89 25.17,149.74 23.84,147.32 M50.4 | v29.2,159.69 30.83,157.58 29.07,155.05 M51.4 | v35.51,167.01 37.03,164.49 35.32,162.58 M52.4 | v42.4,173.35 43.98,170.97 41.64,168.98 M53.4 | v50.34,179.46 51.44,176.43 49.37,175.03 M54.4 | v58.69,184.4 59.55,181.23 57.45,179.87 M55.4 | v67.77,188.44 68.57,185.21 65.52,183.96 M56.4 | M58.4 83.08,189.54 86.67,190.05 v86.32,193.02 | v147.32,95.26 L5.3
  Route14 0.406: v193.18,87.5 v147.32,95.26
  Bottom-w 0.406: v77.23,191.07 86.19,192.99 v86.32,193.02 86.62,193.09 v96.41,194.03 v106.14,193.96 v115.63,193.18 v125.03,191.2 v133.97,188.11 v143.07,184.08 v151.4,179.4 v159.53,173.77 v166.78,167.3 v173.35,160.18 v179,152.21 v183.95,144.18 v187.88,135.3 v191,125.97 v193.02,116.38 v194.22,106.82 v194.32,97.19 v193.18,87.5 v191.2,77.97 v188.18,68.9 v184.31,59.96 v179.36,51.51 v173.9,43.7 v167.46,36 v160.21,29.43 v152.41,23.87 v144.15,18.99 v135.3,14.96 v126.3,11.9 v116.47,9.82 v106.95,8.68 v97.36,8.68 v87.6,9.66 v77.94,11.71 v68.97,14.73 v59.99,18.63 v51.41,23.38 v43.51,29.2 v36.32,35.74 v29.88,42.66 v24.09,50.5 v19.12,58.85 v14.86,67.86 v12,77 v9.88,86.56 v9.01,96.19 v8.65,106.14 v9.59,115.5 v11.61,125.16 v14.63,134.52 v18.57,143.43 v23.41,151.89 v29.2,159.69 v35.51,167.01 v42.4,173.35 v50.34,179.46 v58.69,184.4 v67.77,188.44 77.33,191.04
N$1
  Bottom-w 0.406: Y1.2 64.26,83.36 70.01,83.36 70.01,80.38 RTC.1
N$2
  Bottom-w 0.406: Y1.1 66.8,77.84 RTC.2
N$3
  Bottom-w 0.4: D1.5 81,114 82,114 84.5,116.5 84.5,126 83.5,127 DIS1.4
N$4
  Top 0.406: IC1.13 112.41,167.98 114.47,178.29 M2.1 M2.3 M2.5
N$5
  Bottom-w 0.406: BAT1.VCC@1 62.49,89.73 62.49,78.81 66,75.3 RTC.3
N$6
  Top 0.406: S4.5 S4.3 S4.1 135.73,186.46 131.95,178.29 129.49,175.04 126.81,168.9 124.92,164.51 IC1.12
N$7
  Top 0.406: IC1.11 125.63,162.79 127.82,168.63 130.54,174.65 133.53,178.56 M4.1 135.27,177.51 M4.3 M4.5
N$8
  Top 0.406: IC1.10 126.37,161.43 H4.1 H4.3 H4.5
N$9
  Top 0.406: IC1.9 119.92,161.96 H3.1 H3.3 H3.5
N$10
  Top 0.406: IC1.8 118.08,160.73 120.53,170.92 122.38,176.76 M3.1 M3.3 M3.5
N$11
  Top 0.406: 101.67,58.95 101.67,61.26 | 101.67,61.26 R_OSC.1 | 105.74,71.19 C2_OSC.2 105.74,61.26 101.67,61.26
  Top 0.61: OSC.1 101.67,58.95 | 105.74,71.19 ARDUINO.9
N$12
  Top 0.406: IC1.7 116.41,159.99 119.57,171 121.5,177.33 123.74,181.01 126.81,190.28 S3.1 S3.3 S3.5
N$13
  Top 0.406: OSC.2 111.76,63.66 111.76,65.44 107.85,65.44 | 107.85,65.44 107.85,63.69 | 107.85,65.44 ARDUINO.10
  Top 0.61: 111.76,63.66 R_OSC.2 | 107.85,63.69 C1_OSC.2
N$14
  Top 0.406: SJ1.2 91.57,67.07 C3_MCU1.1
N$15
  Top 0.406: IC1.6 114.78,159.15 H2.5 116.22,172.6 H2.3 H2.1
N$16
  Top 0.406: IC1.20 105.3,160.5 97.18,171.59 97.18,173.38 97,179.6 98.17,183.59 98.24,192.96 S0.1 S0.3 S0.5
N$17
  Top 0.406: IC1.19 106.31,161.7 98.31,171.84 98.05,179.48 M0.1 M0.3 103.96,184.47 M0.5
N$18
  Top 0.406: IC1.18 107.23,162.88 101.65,169.73 H0.3 100.93,174.49 | 100.93,174.49 H0.5 | 100.93,174.49 H0.1
N$19
  Top 0.406: IC1.17 108.19,163.94 104.11,169.16 104.64,173.03 105.56,179.92 106.79,183.43 107.8,192.65 S1.1 S1.3 S1.5
N$20
  Top 0.406: IC1.16 108.98,164.99 105.65,169.16 105.65,173.07 106.39,179.48 M1.1 M1.3 M1.5
N$21
  Top 0.4: R2.2 103,155.5 | IC1.23 110.5,155.5
  Top 0.406: 103,155.5 107.72,155.87 IC1.23
N$22
  Top 0.406: IC1.14 110.7,167.14 112.23,172.5 113.51,178.82 115.31,182.46 117.37,191.81 S2.1 S2.3 S2.5
N$23
  Top 0.406: IC2.13 144.07,153.52 150.61,161.27 M7.1 M7.3 M7.5
N$24
  Top 0.406: IC2.12 153.66,143.93 162.2,151.15 166.36,152.68 173.58,158.11 S9.1 S9.3 S9.5
N$25
  Top 0.406: IC2.11 153.45,142.51 157.99,146.41 162.83,150.31 M9.1 M9.3 M9.5
N$26
  Top 0.406: IC2.10 152.98,141.25 154.09,141.35 H9.1 H9.3 H9.5
N$27
  Top 0.406: IC2.9 147.6,145.09 H8.1 H8.3 H8.5
N$28
  Top 0.406: IC2.8 145.71,144.88 153.03,152.26 157.14,156 M8.1 M8.3 162.68,157.45 M8.5
N$29
  Top 0.406: IC2.7 143.91,145.08 152.35,153 156.41,156.68 160.46,158.9 167.05,165.01 S8.1 S8.3 S8.5
N$30
  Top 0.406: IC2.6 142.07,144.88 H7.5 H7.3 H7.1
N$31
  Top 0.406: IC2.20 131.58,154.37 133.8,165.96 136.59,170.96 139.75,174.28 144.34,182.39 S5.1 S5.3 S5.5
N$32
  Top 0.406: IC2.19 132.69,154.73 134.64,165.38 137.49,170.49 M5.1 M5.3 M5.5
N$33
  Top 0.406: IC2.18 135.08,154.45 H5.5 H5.3 H5.1
N$34
  Top 0.406: IC2.17 136.61,154.8 140.49,162.37 143.86,166.91 147.39,170.17 152.98,177.92 S6.1 S6.3 S6.5
N$35
  Bottom-w 0.4: D1.20 91,114 93.5,114 96,116.5 96,127 DIS1.9
N$36
  Top 0.406: IC2.16 137.94,154.84 141.18,161.9 144.71,166.54 M6.1 M6.3 M6.5
N$37
  Top 0.406: IC2.14 143.34,152.36 142.54,153.15 142.54,153.31 150.03,162.06 153.72,164.27 159.72,171.28 161.88,171.75 S7.1 S7.3 S7.5
N$38
  Top 0.406: R3.2 128.66,146.78 132.17,146.83 IC2.23
N$39
  Top 0.406: IC3.13 164.53,125.39 169.14,126.88 174.37,128.68 M12.1 M12.3 M12.5
N$40
  Top 0.406: IC3.12 167.85,112.99 172.6,113.18 179.05,114 183.6,113.24 193.53,114.31 S14.1 S14.3 S14.5
N$41
  Top 0.406: IC3.11 166.65,111.78 172.85,112.35 179.11,113.05 M14.1 M14.3 M14.5
N$42
  Top 0.406: IC3.10 165.51,110.58 H14.1 H14.3 H14.5
N$43
  Top 0.406: IC3.9 162.92,116.28 H13.1 H13.3 H13.5
N$44
  Top 0.406: IC3.8 161.21,117.22 171.33,119.63 176.77,120.83 181.7,120.76 M13.1 M13.3 M13.5
N$45
  Top 0.406: IC3.7 159.76,117.98 171.08,120.57 176.96,121.71 181.51,121.84 190.56,123.73 S13.1 S13.3 S13.5
N$46
  Top 0.406: IC3.6 158.3,118.8 H12.5 H12.3 H12.1
N$47
  Top 0.406: IC3.20 154.82,128.79 160.39,140.11 166.9,143.97 171.52,145.49 178.98,149.91 S10.1 S10.3 S10.5
N$48
  Top 0.406: IC3.19 156.03,128.79 161.02,139.35 167.54,143.34 M10.1 M10.3 M10.5
N$49
  Top 0.406: IC3.18 157.29,128.46 163.57,135.31 166.24,136.63 H10.5 165.38,137.03 H10.3 H10.1
N$50
  Top 0.406: IC3.17 158.74,127.67 158.69,128.46 164.14,134.08 171.6,137.55 174.98,137.73 184.38,142.03 S11.1 S11.3 186.45,138.78 S11.5
N$51
  Top 0.406: IC3.16 160.01,127.89 164.58,133.03 171.65,136.37 M11.1 M11.3 M11.5
N$52
  Top 0.406: IC3.14 163,126.18 168.66,127.76 174.1,129.6 178.89,130.04 187.98,133.12 S12.1 S12.3 S12.5
N$53
  Top 0.406: R4.2 150.29,126.27 151.75,123.55 IC3.23
N$54
  Top 0.406: IC4.13 167.92,90.22 172.85,89.66 178.41,88.52 183.6,85.86 M17.1 M17.3 M17.5
N$55
  Top 0.406: IC4.12 164.99,78.28 175.61,73.03 178.33,70.81 187.56,66.89 S19.1 S19.3 S19.5
N$56
  Top 0.406: IC4.11 163.28,78.15 168.91,75.24 174.72,72.39 M19.1 M19.3 M19.5
N$57
  Top 0.406: IC4.10 161.76,77.77 H19.1 H19.3 H19.5
N$58
  Top 0.406: IC4.9 162.01,83.33 H18.1 H18.3 H18.5
N$59
  Top 0.406: IC4.8 161.06,84.98 170.93,82.32 177,80.23 M18.1 M18.3 M18.5
N$60
  Top 0.406: IC4.7 160.26,86.62 171.46,83.14 177.34,81.18 181.51,78.91 189.71,76.44 S18.1 S18.3 S18.5
N$61
  Top 0.406: IC4.6 159.31,88.2 H17.5 H17.3 H17.1
N$62
  Top 0.406: IC4.20 160.71,98.06 160.9,98.95 171.21,105.53 173.8,105.84 179.55,105.91 183.92,104.77 193.47,104.77 S15.1 S15.3 194.61,100.28 S15.5
N$63
  Top 0.406: IC4.19 161.78,97.88 172.09,104.64 173.8,104.89 179.49,104.89 M15.1 M15.3 184.44,100.22 M15.5
N$64
  Top 0.406: IC4.18 162.79,96.93 172.09,102.93 H15.1 H15.3 H15.5
N$65
  Top 0.406: IC4.17 163.87,95.92 171.77,98.19 173.67,98.13 180.44,97.43 184.11,96.3 193.66,95.16 194.18,94.64 S16.1 S16.3 S16.5
N$66
  Top 0.406: IC4.16 164.94,94.78 172.22,97.18 173.54,97.18 179.55,96.55 181.39,95.98 M16.1 M16.3 M16.5
N$67
  Top 0.406: IC4.14 166.78,91.55 173.17,90.6 179.05,89.21 183.41,87.44 192.71,85.36 S17.1 S17.3 S17.5
N$68
  Top 0.406: R5.2 155.63,94.94 IC4.23
N$69